# Altium project Cubesat OBC.PrjPcb (part 1 of 2)
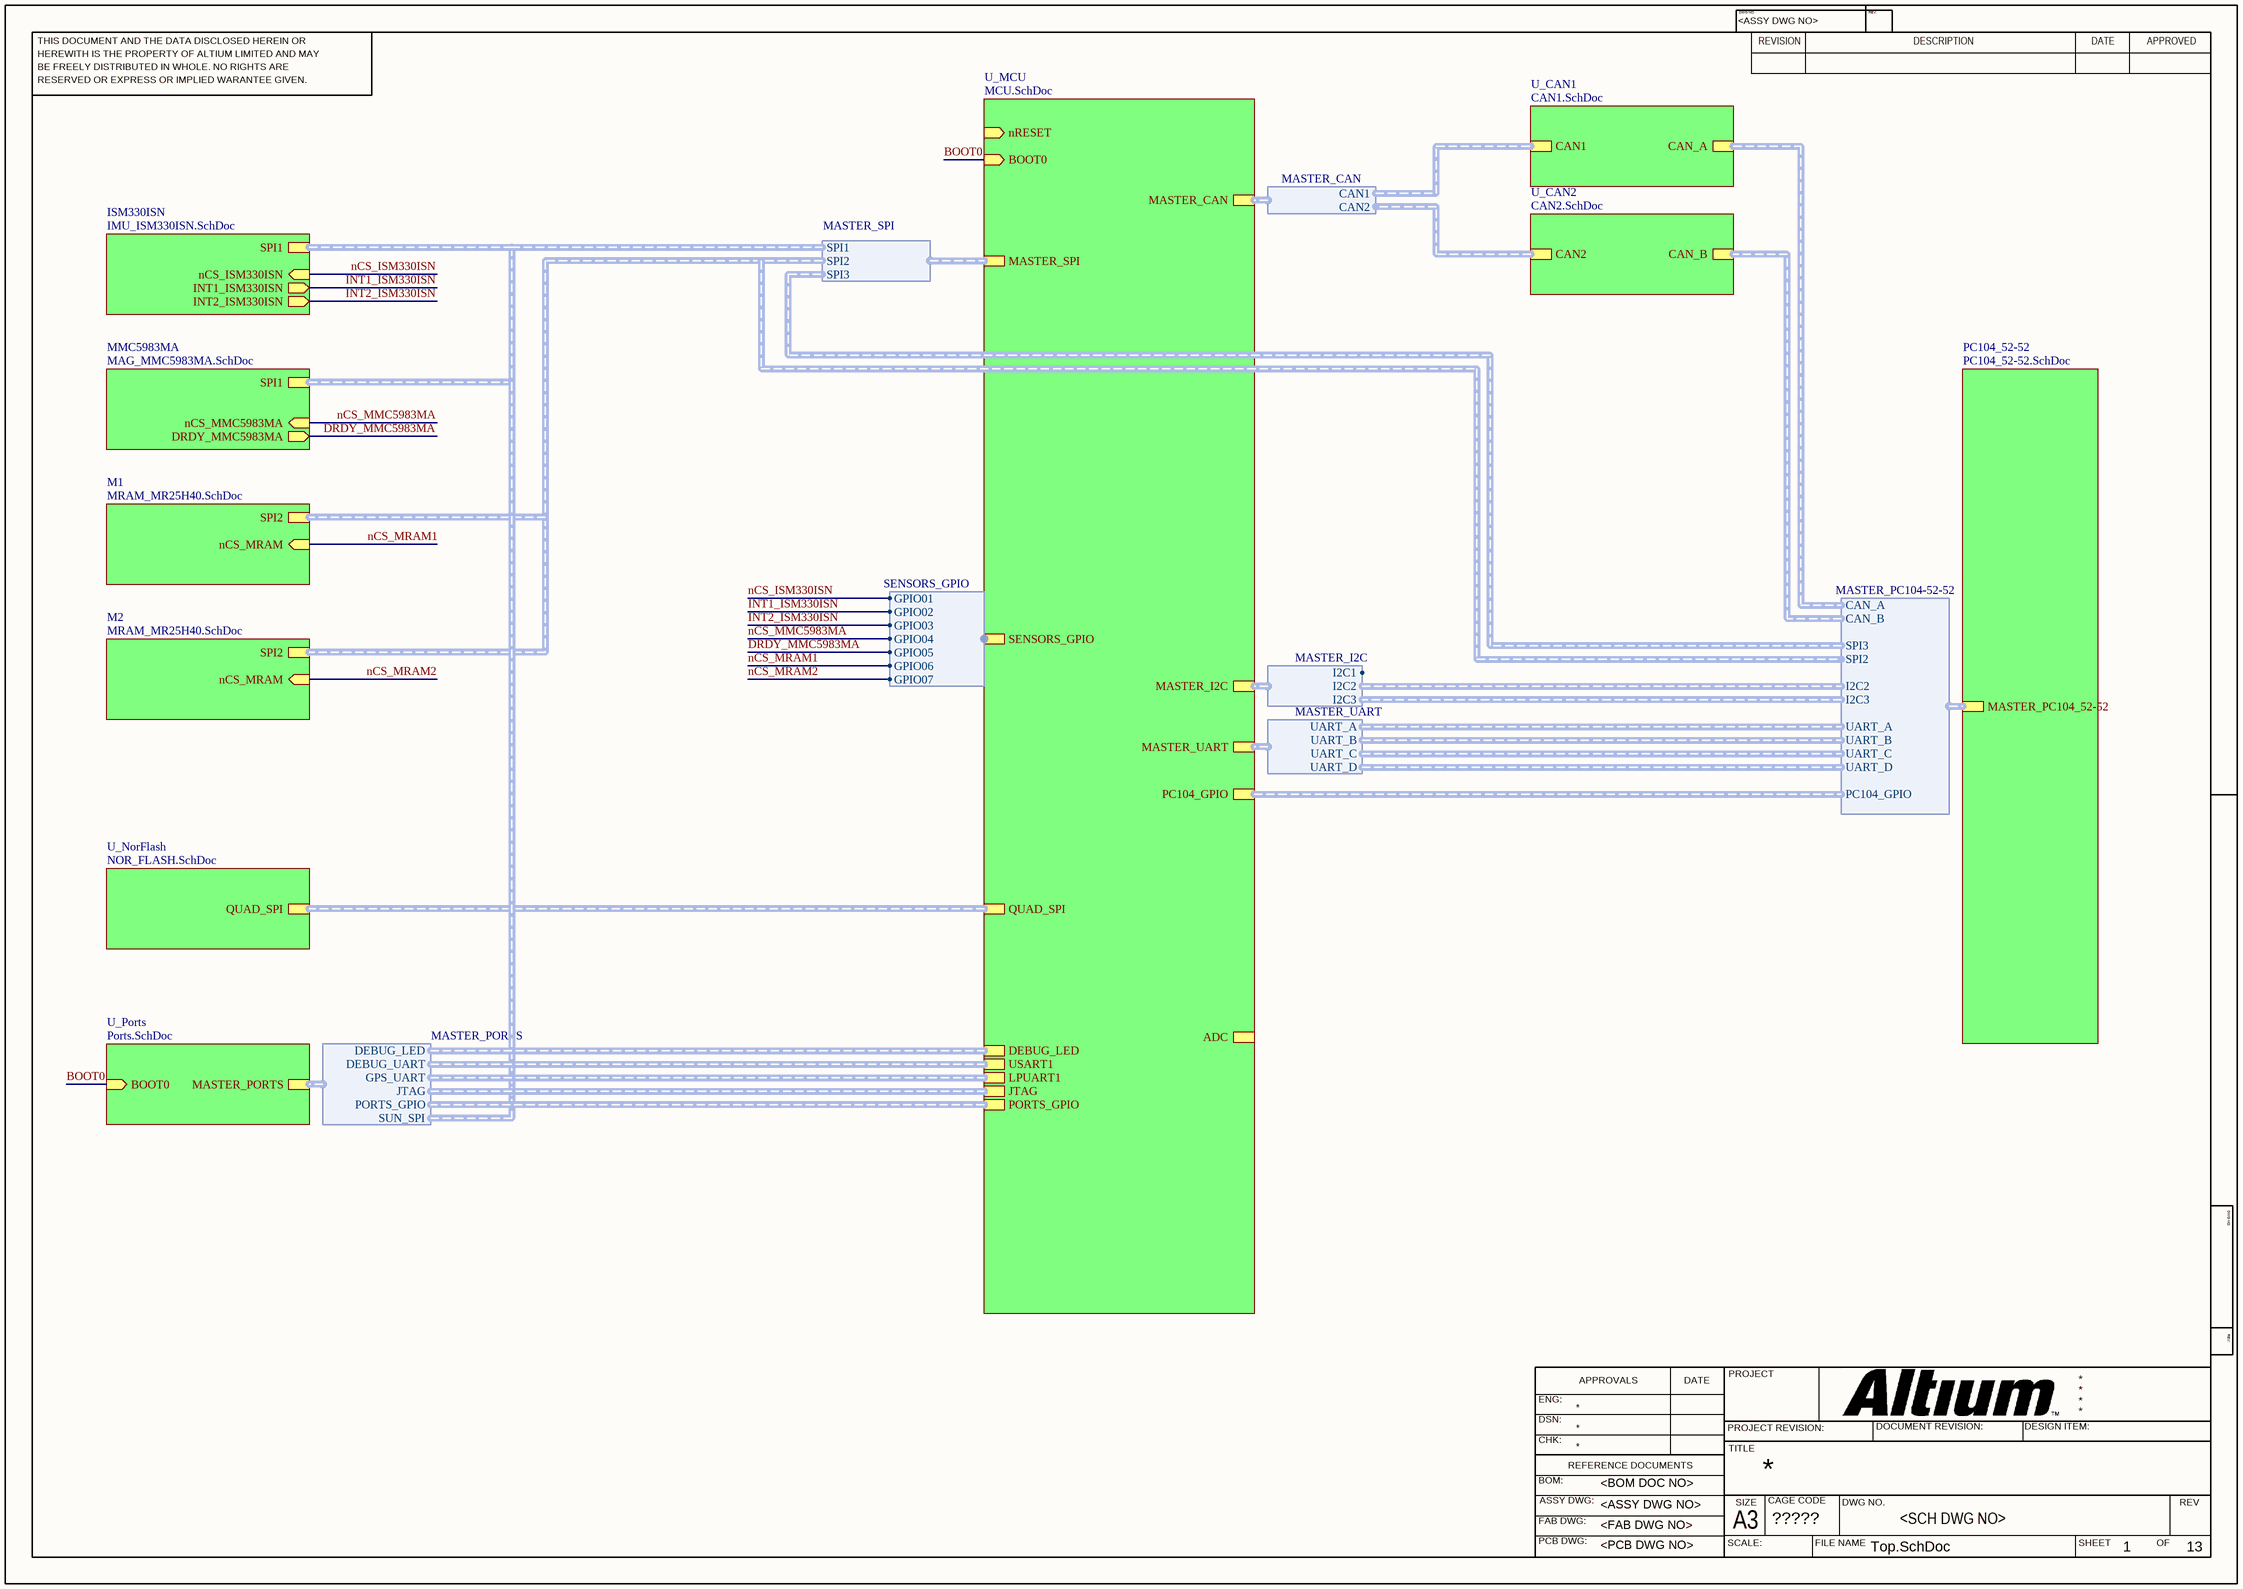
[diagram p0: Top.SchDoc]
CAGE_CODE: ?????; CONTRACT_NUMBER: <CONTRACT NO>; DOC_NO_ASSY_DWG: <ASSY DWG NO>; DOC_NO_BOM: <BOM DOC NO>; DOC_NO_FAB_DWG: <FAB DWG NO>; DOC_NO_SCH_DWG: <SCH DWG NO>; PCB_2_DEC_TOL: +/-.01; PCB_3_DEC_TOL: +/-.010; PCB_ANG_TOL: +/-1/2; PCB_ASSEMBLY_NO: <PCB ASSY NO>; PCB_CHECKER: - -----; PCB_CHECKER_APP_DATE: --/--/----; PCB_DESIGNER: - -----; PCB_DESIGNER_APP_DATE: --/--/----; PCB_DWG_NO: <PCB DWG NO>; PCB_ENGINEER: - -----; PCB_ENGINEER_APP_DATE: --/--/----; PCB_PART_NUMBER: <PCB PN>; PCB_REV: A; SCH_REV: A
13 sheets, 125 parts. Net scope: hierarchical (ports join the sheet entries above them; power ports are global).
Board file: OBC.PcbDoc
Sheets:
  Top.SchDoc
    U_MCU = MCU.SchDoc
      Crystals = Crystals.SchDoc
      MCU_Power = MCU_Power.SchDoc
      Watchdog = Watchdog.SchDoc
    U_CAN1 = CAN1.SchDoc
    U_CAN2 = CAN2.SchDoc
    M1 = MRAM_MR25H40.SchDoc
    MMC5983MA = MAG_MMC5983MA.SchDoc
    ISM330ISN = IMU_ISM330ISN.SchDoc
    M2 = MRAM_MR25H40.SchDoc
    PC104_52-52 = PC104_52-52.SchDoc
    U_NorFlash = NOR_FLASH.SchDoc
    U_Ports = Ports.SchDoc

## Sheet Top.SchDoc
size 420 x 297 mm; SheetNumber: 1; SheetTotal: 13

### Sub-sheets
ISM330ISN = IMU_ISM330ISN.SchDoc: SPI1 (harness SPI1), nCS_ISM330ISN (in), INT1_ISM330ISN (out), INT2_ISM330ISN (out)
M1 = MRAM_MR25H40.SchDoc: nCS_MRAM (in), SPI2 (harness SPI2)
M2 = MRAM_MR25H40.SchDoc: nCS_MRAM (in), SPI2 (harness SPI2)
MMC5983MA = MAG_MMC5983MA.SchDoc: nCS_MMC5983MA (in), SPI1 (harness SPI1), DRDY_MMC5983MA (out)
PC104_52-52 = PC104_52-52.SchDoc: MASTER_PC104_52-52 (harness MASTER_PC104-52-52)
U_CAN1 = CAN1.SchDoc: CAN_A (harness CAN_A), CAN1 (harness CAN1)
U_CAN2 = CAN2.SchDoc: CAN_B (harness CAN_b), CAN2 (harness CAN2)
U_MCU = MCU.SchDoc: MASTER_I2C (harness MASTER_I2C), MASTER_SPI (harness MASTER_SPI), MASTER_UART (harness MASTER_UART), MASTER_CAN (harness MASTER_CAN), QUAD_SPI (harness QUAD_SPI), nRESET (in), BOOT0 (in), JTAG (harness JTAG), DEBUG_LED (harness DEBUG_LED), USART1 (harness USART1), ADC (harness ADC), LPUART1 (harness LPUART1), PC104_GPIO (harness PC104_GPIO), PORTS_GPIO (harness PORTS_GPIO), SENSORS_GPIO (harness SENSORS_GPIO)
U_NorFlash = NOR_FLASH.SchDoc: QUAD_SPI (harness QUAD_SPI)
U_Ports = Ports.SchDoc: MASTER_PORTS (harness MASTER_PORTS), BOOT0 (in)

### Harnesses
MASTER_SPI: SPI1, SPI2, SPI3
MASTER_CAN: CAN1, CAN2
MASTER_UART: UART_A, UART_B, UART_C, UART_D
MASTER_I2C: I2C2, I2C3, I2C1
SENSORS_GPIO: GPIO01, GPIO02, GPIO03, GPIO04, GPIO05, GPIO06, GPIO07
MASTER_PC104-52-52: CAN_A, CAN_B, I2C2, I2C3, PC104_GPIO, SPI2, SPI3, UART_A, UART_B, UART_C, UART_D
MASTER_PORTS: DEBUG_LED, DEBUG_UART, GPS_UART, JTAG, PORTS_GPIO, SUN_SPI

### Nets
BOOT0: sheet U_MCU/BOOT0, sheet U_Ports/BOOT0
DRDY_MMC5983MA: sheet MMC5983MA/DRDY_MMC5983MA, sheet U_MCU/SENSORS_GPIO.GPIO05
INT1_ISM330ISN: sheet ISM330ISN/INT1_ISM330ISN, sheet U_MCU/SENSORS_GPIO.GPIO02
INT2_ISM330ISN: sheet ISM330ISN/INT2_ISM330ISN, sheet U_MCU/SENSORS_GPIO.GPIO03
nCS_ISM330ISN: sheet ISM330ISN/nCS_ISM330ISN, sheet U_MCU/SENSORS_GPIO.GPIO01
nCS_MMC5983MA: sheet MMC5983MA/nCS_MMC5983MA, sheet U_MCU/SENSORS_GPIO.GPIO04
nCS_MRAM1: sheet M1/nCS_MRAM, sheet U_MCU/SENSORS_GPIO.GPIO06  [project net nCS_MRAM]
nCS_MRAM2: sheet M2/nCS_MRAM, sheet U_MCU/SENSORS_GPIO.GPIO07  [project net nCS_MRAM]

### Buses and harness runs
harness sheet ISM330ISN/SPI1 = sheet MMC5983MA/SPI1
harness sheet M1/SPI2 = sheet M2/SPI2
harness sheet U_MCU/QUAD_SPI = sheet U_NorFlash/QUAD_SPI

### Notes on the sheet
- THIS DOCUMENT AND THE DATA DISCLOSED HEREIN OR
- HEREWITH IS THE PROPERTY OF ALTIUM LIMITED AND MAY
- DWG NO:
- REVISION
- REV:
- DESCRIPTION
- DATE
- APPROVED
- BE FREELY DISTRIBUTED IN WHOLE. NO RIGHTS ARE
- RESERVED OR EXPRESS OR IMPLIED WARANTEE GIVEN.
- ENG:
- APPROVALS
- PROJECT
- DSN:
- CHK:
- REFERENCE DOCUMENTS
- PROJECT REVISION:
- TITLE
- DOCUMENT REVISION:
- DESIGN ITEM:
- BOM:
- FAB DWG:
- PCB DWG:
- ASSY DWG:
- SCALE:
- A3
- SIZE
- CAGE CODE
- FILE NAME
- DWG NO.
- SHEET
- OF
- REV

## Sheet MCU.SchDoc
size 420 x 297 mm; SheetNumber: 2; SheetTotal: 13; ENG_APP_DATE: --/--/--; DSN_APP_DATE: --/--/--; CHK_APP_DATE: --/--/--
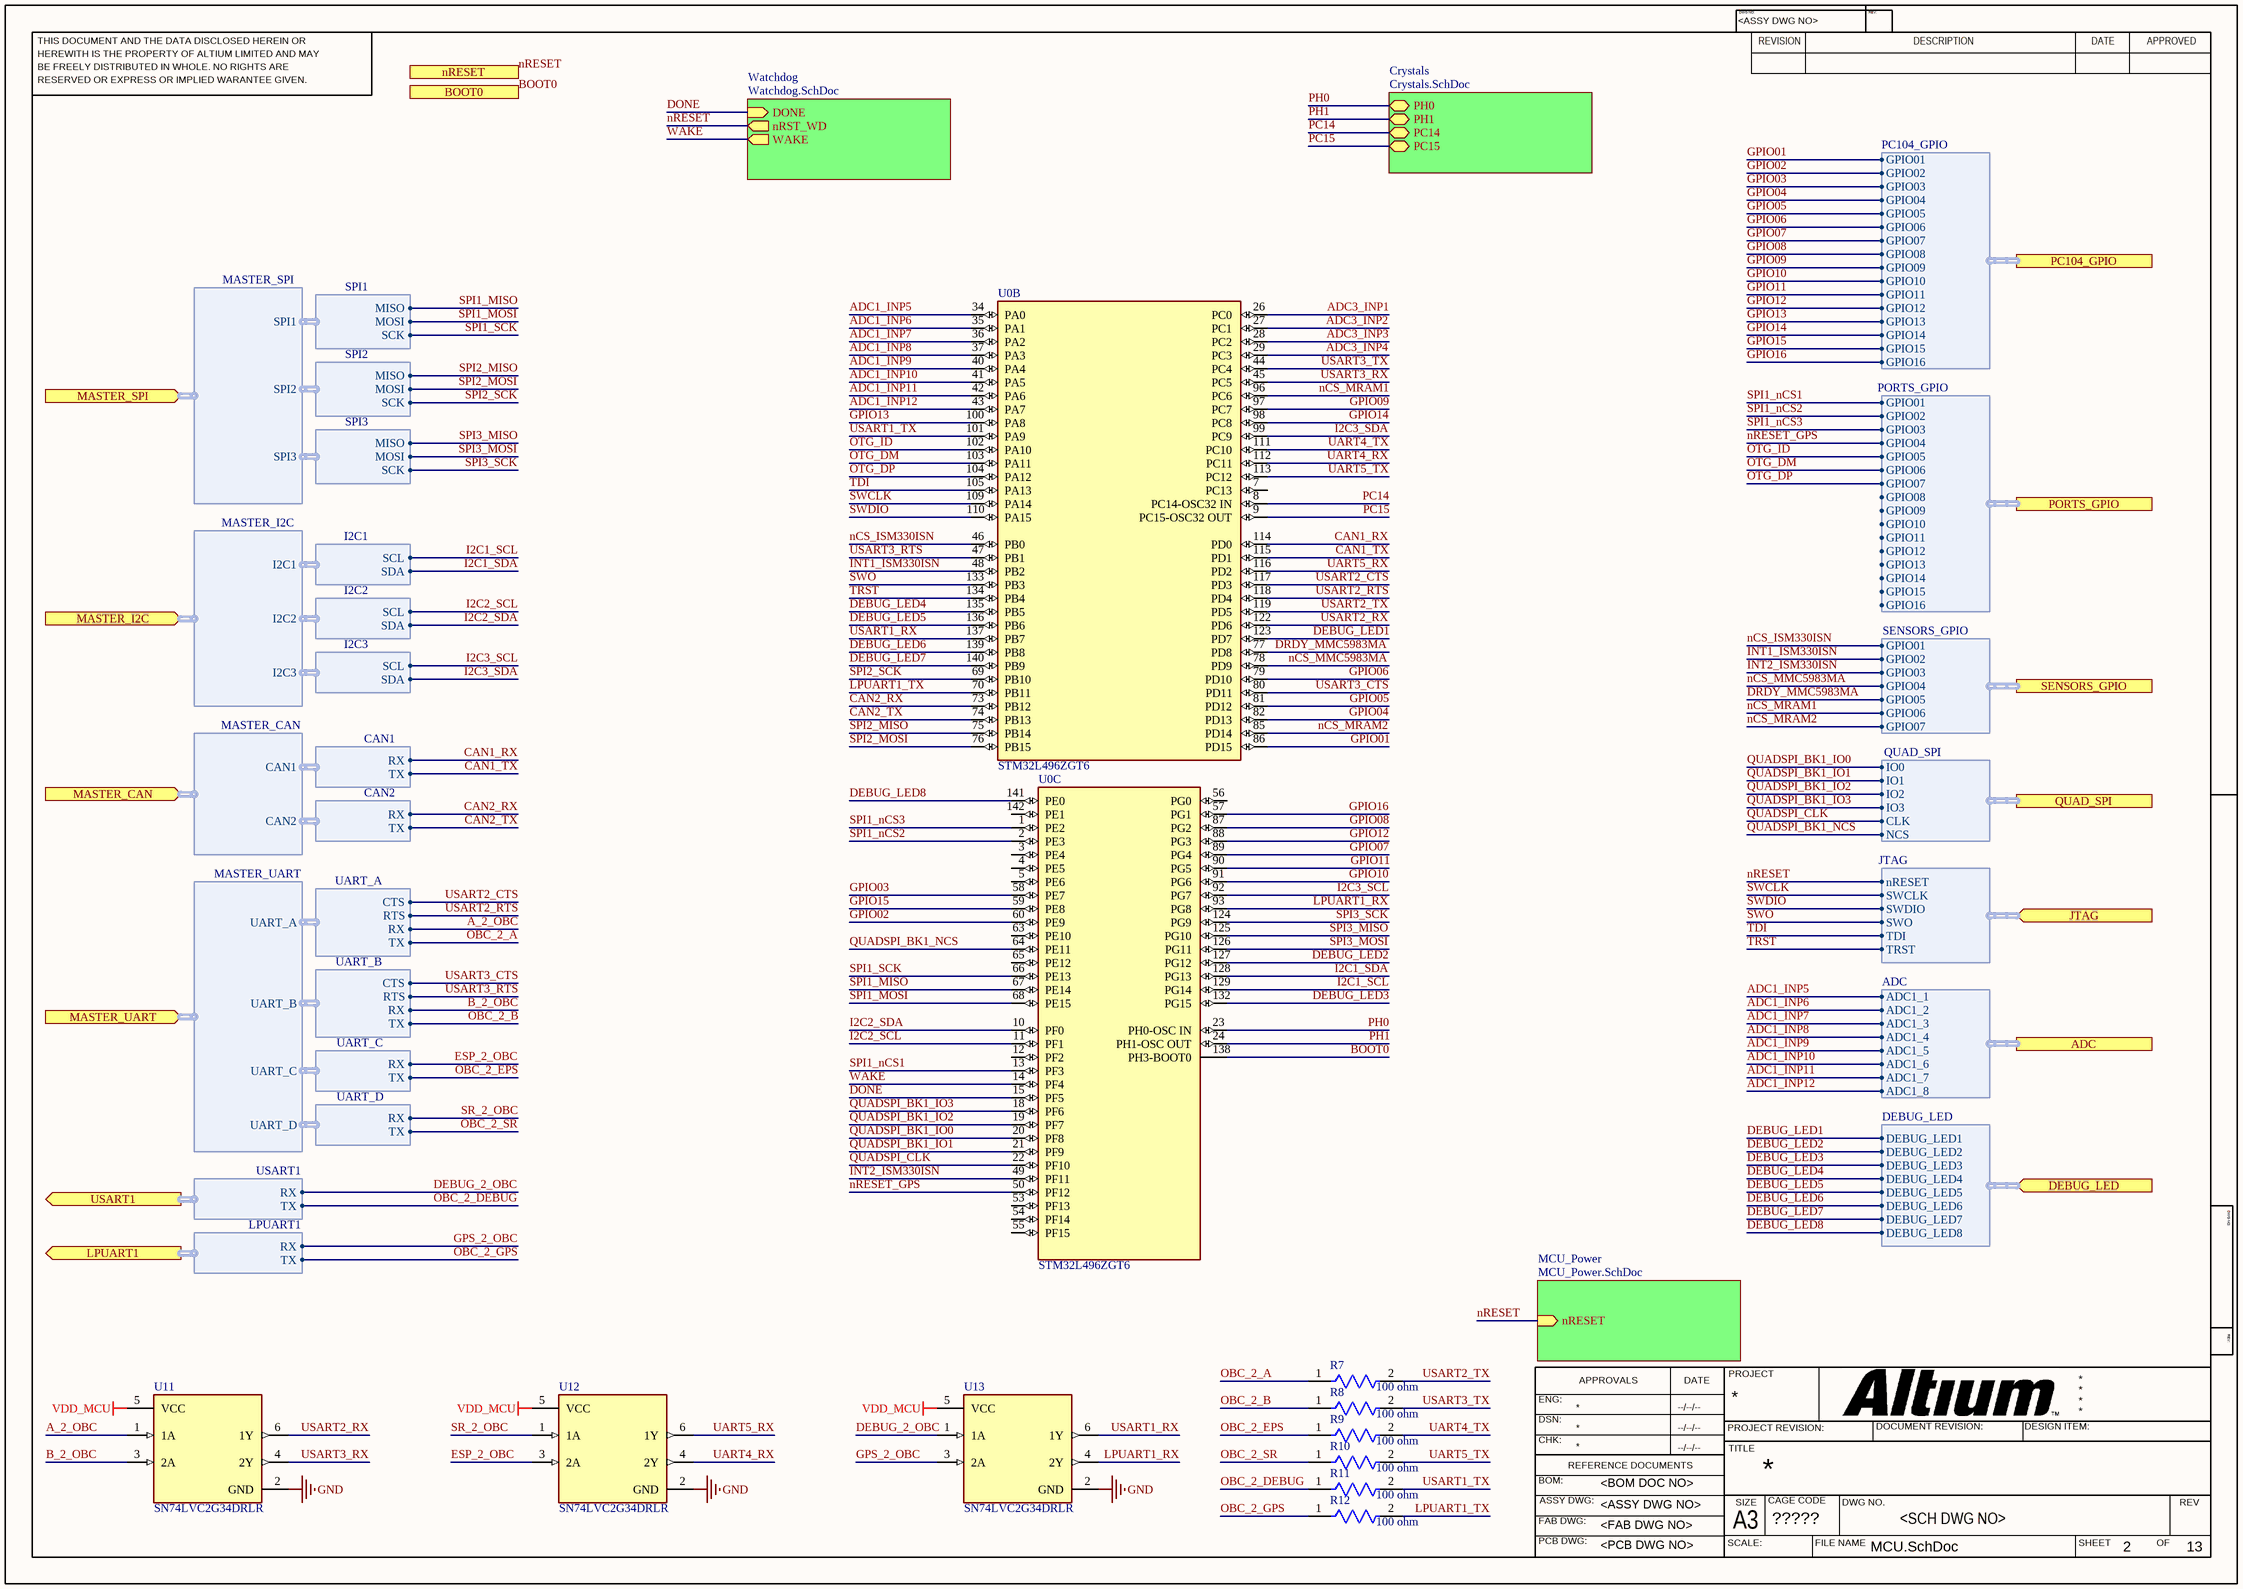
[diagram p1: MCU.SchDoc]

### Parts
R7  100 ohm  [FP-ERJP03-MFG]
R8  100 ohm  [FP-ERJP03-MFG]
R9  100 ohm  [FP-ERJP03-MFG]
R10  100 ohm  [FP-ERJP03-MFG]
R11  100 ohm  [FP-ERJP03-MFG]
R12  100 ohm  [FP-ERJP03-MFG]
U0  STM32L496ZGT6  [FP-LQFP144-1A-MFG]  (parts B,C of 3)
U11  SN74LVC2G34DRLR  [FP-DRL0006A-MFG]
U12  SN74LVC2G34DRLR  [FP-DRL0006A-MFG]
U13  SN74LVC2G34DRLR  [FP-DRL0006A-MFG]

### Sub-sheets
Crystals = Crystals.SchDoc: PC14 (bidir), PC15 (bidir), PH0 (bidir), PH1 (bidir)
MCU_Power = MCU_Power.SchDoc: nRESET (in)
Watchdog = Watchdog.SchDoc: nRST_WD (out), DONE (in), WAKE (out)

### Ports
ADC (harness ADC), BOOT0 (in), DEBUG_LED (in, harness DEBUG_LED), JTAG (in, harness JTAG), LPUART1 (out, harness LPUART1), MASTER_CAN (in, harness MASTER_CAN), MASTER_I2C (in, harness MASTER_I2C), MASTER_SPI (in, harness MASTER_SPI), MASTER_UART (in, harness MASTER_UART), nRESET (in), PC104_GPIO (harness PC104_GPIO), PORTS_GPIO (harness PORTS_GPIO), QUAD_SPI (harness QUAD_SPI), SENSORS_GPIO (harness SENSORS_GPIO), USART1 (out, harness USART1)

### Harnesses
MASTER_I2C: I2C1, I2C2, I2C3
MASTER_UART: UART_A, UART_B, UART_C, UART_D
I2C1: SDA, SCL
MASTER_SPI: SPI1, SPI2, SPI3
SPI1: MOSI, MISO, SCK
SPI2: MOSI, MISO, SCK
SPI3: MISO, SCK, MOSI
MASTER_CAN: CAN1, CAN2
CAN1: TX, RX
CAN2: TX, RX
ADC: ADC1_1, ADC1_2, ADC1_3, ADC1_4, ADC1_5, ADC1_6, ADC1_7, ADC1_8
JTAG: nRESET, SWCLK, SWDIO, SWO, TDI, TRST
I2C2: SDA, SCL
UART_A: TX, RX, RTS, CTS
UART_B: TX, RX, RTS, CTS
QUAD_SPI: IO0, IO1, CLK, NCS, IO2, IO3
I2C3: SDA, SCL
USART1: TX, RX
LPUART1: TX, RX
UART_D: TX, RX
UART_C: RX, TX
DEBUG_LED: DEBUG_LED1, DEBUG_LED2, DEBUG_LED3, DEBUG_LED4, DEBUG_LED5, DEBUG_LED6, DEBUG_LED7, DEBUG_LED8
SENSORS_GPIO: GPIO01, GPIO02, GPIO03, GPIO04, GPIO05, GPIO06, GPIO07
PORTS_GPIO: GPIO01, GPIO02, GPIO03, GPIO04, GPIO05, GPIO06, GPIO07, GPIO08, GPIO09, GPIO10, GPIO11, GPIO12, GPIO13, GPIO14, GPIO15, GPIO16
PC104_GPIO: GPIO01, GPIO02, GPIO03, GPIO04, GPIO05, GPIO06, GPIO07, GPIO08, GPIO09, GPIO10, GPIO11, GPIO12, GPIO13, GPIO14, GPIO15, GPIO16

### Nets
GND: U11.2(GND) U12.2(GND) U13.2(GND)
VDD_MCU: U11.5(VCC) U12.5(VCC) U13.5(VCC)
A_2_OBC: U11.1(1A) ; harness UART_A.RX
ADC1_INP5: U0.34(PA0) ; port ADC.ADC1_1
ADC1_INP6: U0.35(PA1) ; port ADC.ADC1_2
ADC1_INP7: U0.36(PA2) ; port ADC.ADC1_3
ADC1_INP8: U0.37(PA3) ; port ADC.ADC1_4
ADC1_INP9: U0.40(PA4) ; port ADC.ADC1_5
ADC1_INP10: U0.41(PA5) ; port ADC.ADC1_6
ADC1_INP11: U0.42(PA6) ; port ADC.ADC1_7
ADC1_INP12: U0.43(PA7) ; port ADC.ADC1_8
ADC3_INP1: U0.26(PC0)
ADC3_INP2: U0.27(PC1)
ADC3_INP3: U0.28(PC2)
ADC3_INP4: U0.29(PC3)
B_2_OBC: U11.3(2A) ; harness UART_B.RX
BOOT0: U0.138(PH3-BOOT0) ; port BOOT0
CAN1_RX: U0.114(PD0) ; harness CAN1.RX
CAN1_TX: U0.115(PD1) ; harness CAN1.TX
CAN2_RX: U0.73(PB12) ; harness CAN2.RX
CAN2_TX: U0.74(PB13) ; harness CAN2.TX
DEBUG_2_OBC: U13.1(1A) ; port USART1.RX
DEBUG_LED1: U0.123(PD7) ; port DEBUG_LED.DEBUG_LED1
DEBUG_LED2: U0.127(PG12) ; port DEBUG_LED.DEBUG_LED2
DEBUG_LED3: U0.132(PG15) ; port DEBUG_LED.DEBUG_LED3
DEBUG_LED4: U0.135(PB5) ; port DEBUG_LED.DEBUG_LED4
DEBUG_LED5: U0.136(PB6) ; port DEBUG_LED.DEBUG_LED5
DEBUG_LED6: U0.139(PB8) ; port DEBUG_LED.DEBUG_LED6
DEBUG_LED7: U0.140(PB9) ; port DEBUG_LED.DEBUG_LED7
DEBUG_LED8: U0.141(PE0) ; port DEBUG_LED.DEBUG_LED8
DONE: U0.15(PF5) ; sheet Watchdog/DONE
DRDY_MMC5983MA: U0.77(PD8) ; port SENSORS_GPIO.GPIO05
ESP_2_OBC: U12.3(2A) ; harness UART_C.RX
GPIO01: U0.86(PD15) ; port PC104_GPIO.GPIO01
GPIO02: U0.60(PE9) ; port PC104_GPIO.GPIO02
GPIO03: U0.58(PE7) ; port PC104_GPIO.GPIO03
GPIO04: U0.82(PD13) ; port PC104_GPIO.GPIO04
GPIO05: U0.81(PD12) ; port PC104_GPIO.GPIO05
GPIO06: U0.79(PD10) ; port PC104_GPIO.GPIO06
GPIO07: U0.89(PG4) ; port PC104_GPIO.GPIO07
GPIO08: U0.87(PG2) ; port PC104_GPIO.GPIO08
GPIO09: U0.97(PC7) ; port PC104_GPIO.GPIO09
GPIO10: U0.91(PG6) ; port PC104_GPIO.GPIO10
GPIO11: U0.90(PG5) ; port PC104_GPIO.GPIO11
GPIO12: U0.88(PG3) ; port PC104_GPIO.GPIO12
GPIO13: U0.100(PA8) ; port PC104_GPIO.GPIO13
GPIO14: U0.98(PC8) ; port PC104_GPIO.GPIO14
GPIO15: U0.59(PE8) ; port PC104_GPIO.GPIO15
GPIO16: U0.57(PG1) ; port PC104_GPIO.GPIO16
GPS_2_OBC: U13.3(2A) ; port LPUART1.RX
I2C1_SCL: U0.129(PG14) ; harness I2C1.SCL
I2C1_SDA: U0.128(PG13) ; harness I2C1.SDA
I2C2_SCL: U0.11(PF1) ; harness I2C2.SCL
I2C2_SDA: U0.10(PF0) ; harness I2C2.SDA
I2C3_SCL: U0.92(PG7) ; harness I2C3.SCL
I2C3_SDA: U0.99(PC9) ; harness I2C3.SDA
INT1_ISM330ISN: U0.48(PB2) ; port SENSORS_GPIO.GPIO02
INT2_ISM330ISN: U0.49(PF11) ; port SENSORS_GPIO.GPIO03
LPUART1_RX: U0.93(PG8) U13.4(2Y)
LPUART1_TX: R12.2 U0.70(PB11)
nCS_ISM330ISN: U0.46(PB0) ; port SENSORS_GPIO.GPIO01
nCS_MMC5983MA: U0.78(PD9) ; port SENSORS_GPIO.GPIO04
nCS_MRAM1: U0.96(PC6) ; port SENSORS_GPIO.GPIO06  [project net nCS_MRAM]
nCS_MRAM2: U0.85(PD14) ; port SENSORS_GPIO.GPIO07  [project net nCS_MRAM]
nRESET: port nRESET, sheet MCU_Power/nRESET, sheet Watchdog/nRST_WD, port JTAG.nRESET
nRESET_GPS: U0.50(PF12) ; port PORTS_GPIO.GPIO04
OBC_2_A: R7.1 ; harness UART_A.TX
OBC_2_B: R8.1 ; harness UART_B.TX
OBC_2_DEBUG: R11.1 ; port USART1.TX
OBC_2_EPS: R9.1 ; harness UART_C.TX
OBC_2_GPS: R12.1 ; port LPUART1.TX
OBC_2_SR: R10.1 ; harness UART_D.TX
OTG_DM: U0.103(PA11) ; port PORTS_GPIO.GPIO06
OTG_DP: U0.104(PA12) ; port PORTS_GPIO.GPIO07
OTG_ID: U0.102(PA10) ; port PORTS_GPIO.GPIO05
PC14: U0.8(PC14-OSC32_IN) ; sheet Crystals/PC14
PC15: U0.9(PC15-OSC32_OUT) ; sheet Crystals/PC15
PH0: U0.23(PH0-OSC_IN) ; sheet Crystals/PH0
PH1: U0.24(PH1-OSC_OUT) ; sheet Crystals/PH1
QUADSPI_BK1_IO0: U0.20(PF8) ; port QUAD_SPI.IO0
QUADSPI_BK1_IO1: U0.21(PF9) ; port QUAD_SPI.IO1
QUADSPI_BK1_IO2: U0.19(PF7) ; port QUAD_SPI.IO2
QUADSPI_BK1_IO3: U0.18(PF6) ; port QUAD_SPI.IO3
QUADSPI_BK1_NCS: U0.64(PE11) ; port QUAD_SPI.NCS
QUADSPI_CLK: U0.22(PF10) ; port QUAD_SPI.CLK
SPI1_MISO: U0.67(PE14) ; harness SPI1.MISO
SPI1_MOSI: U0.68(PE15) ; harness SPI1.MOSI
SPI1_nCS1: U0.13(PF3) ; port PORTS_GPIO.GPIO01
SPI1_nCS2: U0.2(PE3) ; port PORTS_GPIO.GPIO02
SPI1_nCS3: U0.1(PE2) ; port PORTS_GPIO.GPIO03
SPI1_SCK: U0.66(PE13) ; harness SPI1.SCK
SPI2_MISO: U0.75(PB14) ; harness SPI2.MISO
SPI2_MOSI: U0.76(PB15) ; harness SPI2.MOSI
SPI2_SCK: U0.69(PB10) ; harness SPI2.SCK
SPI3_MISO: U0.125(PG10) ; harness SPI3.MISO
SPI3_MOSI: U0.126(PG11) ; harness SPI3.MOSI
SPI3_SCK: U0.124(PG9) ; harness SPI3.SCK
SR_2_OBC: U12.1(1A) ; harness UART_D.RX
SWCLK: U0.109(PA14) ; port JTAG.SWCLK
SWDIO: U0.110(PA15) ; port JTAG.SWDIO
SWO: U0.133(PB3) ; port JTAG.SWO
TDI: U0.105(PA13) ; port JTAG.TDI
TRST: U0.134(PB4) ; port JTAG.TRST
UART4_RX: U0.112(PC11) U12.4(2Y)
UART4_TX: R9.2 U0.111(PC10)
UART5_RX: U0.116(PD2) U12.6(1Y)
UART5_TX: R10.2 U0.113(PC12)
USART1_RX: U0.137(PB7) U13.6(1Y)
USART1_TX: R11.2 U0.101(PA9)
USART2_CTS: U0.117(PD3) ; harness UART_A.CTS  [project net UART_A_CTS]
USART2_RTS: U0.118(PD4) ; harness UART_A.RTS  [project net UART_A_RTS]
USART2_RX: U0.122(PD6) U11.6(1Y)
USART2_TX: R7.2 U0.119(PD5)
USART3_CTS: U0.80(PD11) ; harness UART_B.CTS  [project net UART_B_CTS]
USART3_RTS: U0.47(PB1) ; harness UART_B.RTS  [project net UART_B_RTS]
USART3_RX: U0.45(PC5) U11.4(2Y)
USART3_TX: R8.2 U0.44(PC4)
WAKE: U0.14(PF4) ; sheet Watchdog/WAKE

Not connected (* = marked no-connect by the designer): U0 3(PE4) 4(PE5) 5(PE6) 7(PC13) 12(PF2) 53(PF13) 54(PF14) 55(PF15) 56(PG0) 63(PE10) 65(PE12) 142(PE1)

### Notes on the sheet
- THIS DOCUMENT AND THE DATA DISCLOSED HEREIN OR
- HEREWITH IS THE PROPERTY OF ALTIUM LIMITED AND MAY
- DWG NO:
- REVISION
- REV:
- DESCRIPTION
- DATE
- APPROVED
- BE FREELY DISTRIBUTED IN WHOLE. NO RIGHTS ARE
- RESERVED OR EXPRESS OR IMPLIED WARANTEE GIVEN.
- ENG:
- APPROVALS
- PROJECT
- DSN:
- CHK:
- REFERENCE DOCUMENTS
- PROJECT REVISION:
- TITLE
- DOCUMENT REVISION:
- DESIGN ITEM:
- BOM:
- FAB DWG:
- PCB DWG:
- ASSY DWG:
- SCALE:
- A3
- SIZE
- CAGE CODE
- FILE NAME
- DWG NO.
- SHEET
- OF
- REV

### Library data of the parts
R7-R12 = CMP-00287-21317759-1: ERJ-P03F1000V SMD Chip Resistor, 100 Ohm, ± 1%, 200 mW, 0603 [1608 Metric], Thick Film, Anti-Surge; Temperature Coefficient: 200ppm/°C; Resistance: 100Ω; Voltage Rating (DC): 150V; Power Rating: 200mW; Tolerance: 1%; Termination: Tab; RoHS: Compliant; Composition: Thick Film; Min Operating Temperature: -55°C; Contact Plating: Tin; Case Code (Metric): 1608; Case/Package: 0603; Radiation Hardening: No; Mount: Surface Mount; Voltage Rating: 150V; Packaging: Cut Tape; Length: 1.6mm; REACH SVHC: No SVHC; Max Operating Temperature: 155°C; Depth: 800µm; Number of Pins: 2; Lifecycle Status: Production; Schedule B: 8533210045, 8533210045; Military Standard: Not; Height: 550µm; NexarPartId: 21317759; Case Code (Imperial): 0603
U0 = CMP-12105-000038-2: IC MCU 32BIT 1MB FLASH 144LQFP; Manufacturer Package Identifier: LQFP144-1A; NexarPartId: 80927210; Number of Channels: 24; Number of I2C Channels: 4; Frequency: 80MHz; Number of USB Channels: 1; Nominal Supply Current: 30nA; Data Bus Width: 32b; Number of Timers/Counters: 2; Number of USART Channels: 3; Max Junction Temperature (Tj): 105°C; Number of I/Os: 115; Number of PWM Channels: 28; Interface: CAN, I2C, I2S, IrDA, LIN, SPI, UART, USART, USB; Core Architecture: ARM Cortex-M4; RAM Size: 320kB; Min Supply Voltage: 1.05V; Max Supply Voltage: 3.6V; Min Operating Temperature: -40°C; RoHS: Non-Compliant; Memory Size: 1MB; Number of A/D Converters: 3; Number of SPI Channels: 3; Max Operating Temperature: 85°C; Memory Type: FLASH; Height: 1.6mm; Ambient Temperature Range High: 85°C; Schedule B: 8542310000, 8542310000; Number of D/A Converters: 2; Number of UART Channels: 2; Lifecycle Status: Production; Flash Memory Size: 1MB; Number of ADC Channels: 24
U11-U13 = CMP-0859-00812-4: IC BUFFER NON-INVERT 5.5V 6SOT; Number of Bits per Element: 1; Number of Bits: 2; Low Level Output Current: 32mA; Polarity: Non-Inverting; Min Supply Voltage: 1.65V; Propagation Delay: 8.6ns; High Level Output Current: -32mA; Quiescent Current: 10uA; Contact Plating: Gold; Case/Package: SOT; Technology: CMOS; Min Operating Temperature: -40°C; Number of Elements: 2; REACH SVHC: No SVHC; Number of Channels: 2; Series: 74LVC; Number of Pins: 6; Mount: Surface Mount; Logic Function: Buffer; Number of Output Lines: 2; Packaging: Tape and Reel; Package Quantity: 4000; Radiation Hardening: No; Number of Gates: 2; Turn-On Delay Time: 8.6ns; Max Operating Temperature: 125°C; Max Supply Voltage: 5.5V; Lead Free: Lead Free; RoHS Compliant: Yes; Number of Outputs: 2; Number of Inputs: 2; Number of Input Lines: 2

## Sheet Crystals.SchDoc
size 420 x 297 mm; SheetNumber: 5; SheetTotal: 13
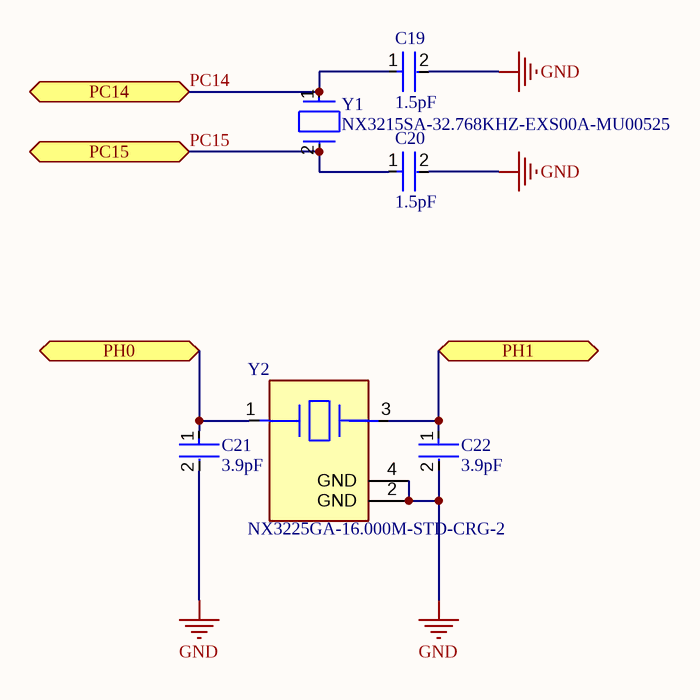
[diagram p2: Crystals.SchDoc]

### Parts
C19  1.5pF  [FP-C0603C-CF-MFG]
C20  1.5pF  [FP-C0603C-CF-MFG]
C21  3.9pF  [FP-CBR06C-MFG]
C22  3.9pF  [FP-CBR06C-MFG]
Y1  NX3215SA-32.768KHZ-EXS00A-MU00525  [FP-NX3215SA-MFG]
Y2  NX3225GA-16.000M-STD-CRG-2  [FP-NX3225GA-MFG]

### Ports
PC14 (bidir), PC15 (bidir), PH0 (bidir), PH1 (bidir)

### Nets
GND: C19.2 C20.2 C21.2 C22.2 Y2.2(GND) Y2.4(GND)
PC14: C19.1 Y1.1 ; port PC14
PC15: C20.1 Y1.2 ; port PC15
PH0: C21.1 Y2.1 ; port PH0
PH1: C22.1 Y2.3 ; port PH1

### Notes on the sheet
- THIS DOCUMENT AND THE DATA DISCLOSED HEREIN OR
- HEREWITH IS THE PROPERTY OF ALTIUM LIMITED AND MAY
- DWG NO:
- REVISION
- REV:
- DESCRIPTION
- DATE
- APPROVED
- BE FREELY DISTRIBUTED IN WHOLE. NO RIGHTS ARE
- RESERVED OR EXPRESS OR IMPLIED WARANTEE GIVEN.
- ENG:
- APPROVALS
- PROJECT
- DSN:
- CHK:
- REFERENCE DOCUMENTS
- PROJECT REVISION:
- TITLE
- DOCUMENT REVISION:
- DESIGN ITEM:
- BOM:
- FAB DWG:
- PCB DWG:
- ASSY DWG:
- SCALE:
- A3
- SIZE
- CAGE CODE
- FILE NAME
- DWG NO.
- SHEET
- OF
- REV

### Library data of the parts
C19 C20 = CMP-2006-03373-2: CAP CER 1.5PF 100V NP0 0603; Manufacturer Part Number: C0603C159C1GACTU; Manufacturer: KEMET; Material: Ceramic; Temperature Coefficient: 30ppm/°C; Temperature Characteristic: C0G; Tolerance: 0.25 pF; Automotive Grade: Grade 1; Mouser Description: Multilayer Ceramic Capacitors MLCC - SMD/SMT 100volts 1.5pF C0G 0.25%; Lead Free: Yes; Value: 1.5 pF; Temperature Range Low: -55°C; Temperature: -55°C to +125°C; Device Class L1: Passive Components; Device Class L3: Ceramic Capacitors; Package: C0603C-CF; Category: Cap; ComponentLink2Description: Datasheet; Voltage Rating: 100 V; Device Class L2: Capacitors; Height: 0.87mm; Temperature Range High: +125°C; RoHS: TRUE; Octopart: https://octopart.com/c0603c159c1gactu-kemet-9144220; Digikey Description: CAP CER 1.5PF 100V NP0 0603; Automotive: Yes; ComponentLink2URL: https://api.kemet.com/component-edge/download/datasheet/C0603C100J5GACAUTO.pdf; Capacitance: 1.5 pF
C21 C22 = CMP-2006-02987-2: CAP CER 3.9PF 250V C0G/NP0 0603; Manufacturer Part Number: CBR06C399CAGAC; Manufacturer: KEMET; Material: Ceramic; Tolerance: 0.25 pF; Temperature Characteristic: C0G; Temperature Coefficient: 30ppm/°C; Octopart: https://octopart.com/cbr06c399cagac-kemet-20446767; Height: 0.87mm; Category: Cap; Temperature: -55°C to +125°C; Device Class L1: Passive Components; Capacitance: 3.9 pF; Device Class L3: Ceramic Capacitors; Value: 3.9 pF; Voltage Rating: 250 V; Mouser Description: Multilayer Ceramic Capacitors MLCC - SMD/SMT 250volts 3.9pF C0G 0603 .25pF Tol RF; Temperature Range High: +125°C; Ipc Land Pattern Name: CAPC16080X80; ComponentLink2Description: Datasheet; Temperature Range Low: -55°C; Digikey Description: CAP CER 3.9PF 250V C0G/NP0 0603; ComponentLink2URL: https://content.kemet.com/datasheets/KEM_C1030_CBR_SMD.pdf; Lead Free: Yes; Package: CBR06C; Device Class L2: Capacitors; RoHS: TRUE; Automotive: No
Y1 = CMP-200220-000018-1: CRYSTAL 32.7680KHZ 6PF SMD; ESR (Equivalent Series Resistance): 70kR; Load Capacitance: 6pF; Frequency: 32.768kHz; Case/Package: SMD/SMT; Packaging: Tape and Reel; Ratings: AEC-Q200; Max Operating Temperature: 85°C; Mount: Surface Mount; Min Operating Temperature: -40°C
Y2 = CMP-200220-000007-1: CRYSTAL 16.0000MHZ 8PF SMD; Frequency Stability: 30ppm; Frequency Tolerance: 20ppm; Frequency: 16MHz; ESR (Equivalent Series Resistance): 80R; Min Operating Temperature: -40°C; Mount: Surface Mount; Width: 0.098inch; Case/Package: SMD/SMT; Max Operating Temperature: 85°C; Number of Pins: 4; Length: 0.126inch; Load Capacitance: 8pF; Packaging: Tape and Reel; Package Quantity: 3000; Height: 0.035inch

## Sheet MCU_Power.SchDoc
size 420 x 297 mm; SheetNumber: 3; SheetTotal: 13
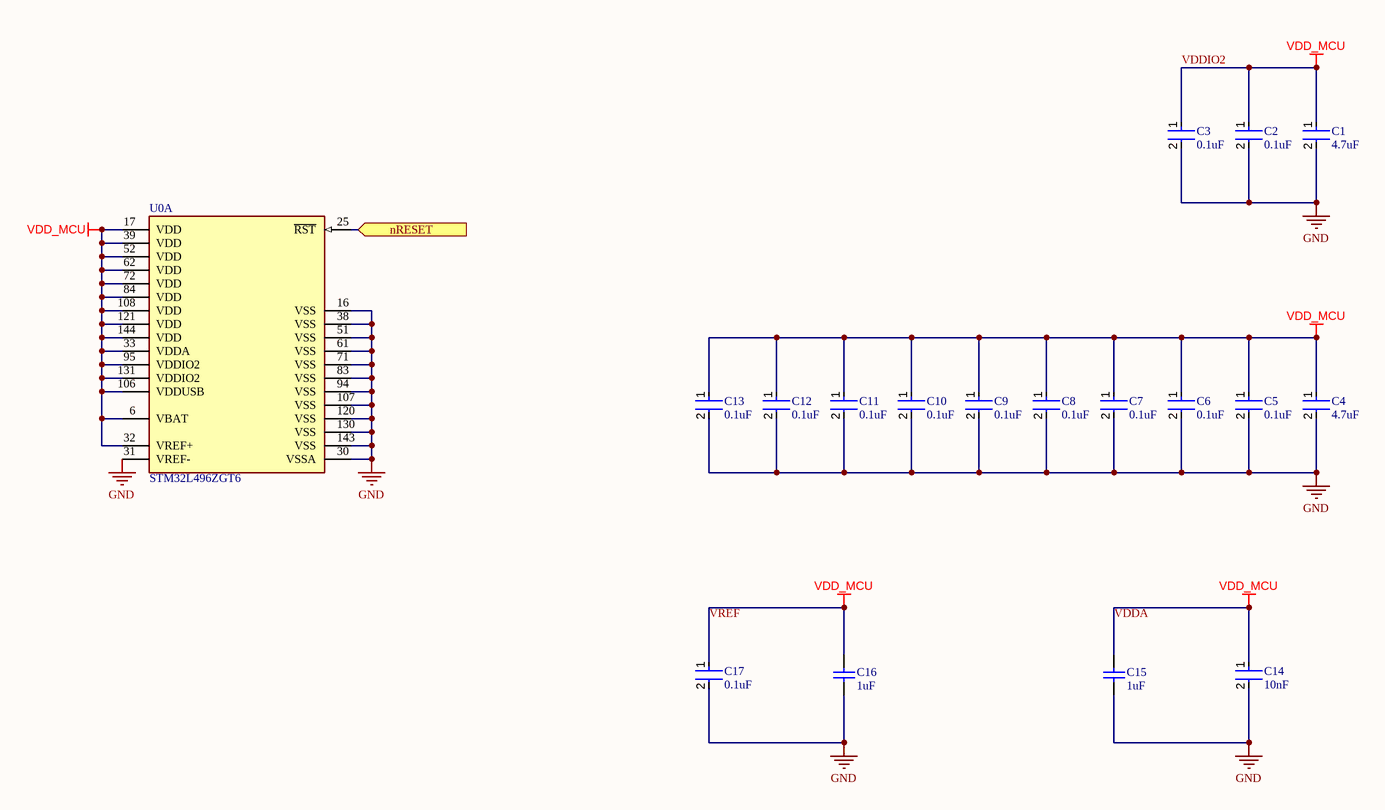
[diagram p3: MCU_Power.SchDoc]

### Parts
C1  4.7uF  [FP-GRM188-0_15-IPC_A]
C2  0.1uF  [FP-C0603C-CF-MFG]
C3  0.1uF  [FP-C0603C-CF-MFG]
C4  4.7uF  [FP-GRM188-0_15-IPC_A]
C5  0.1uF  [FP-C0603C-CF-MFG]
C6  0.1uF  [FP-C0603C-CF-MFG]
C7  0.1uF  [FP-C0603C-CF-MFG]
C8  0.1uF  [FP-C0603C-CF-MFG]
C9  0.1uF  [FP-C0603C-CF-MFG]
C10  0.1uF  [FP-C0603C-CF-MFG]
C11  0.1uF  [FP-C0603C-CF-MFG]
C12  0.1uF  [FP-C0603C-CF-MFG]
C13  0.1uF  [FP-C0603C-CF-MFG]
C14  10nF  [FP-GRM188-0_1-e0_2_0_5-IPC_A]
C15  1uF  [CAPC1608X90X35LL15T15]
C16  1uF  [CAPC1608X90X35LL15T15]
C17  0.1uF  [FP-C0603C-CF-MFG]
U0  STM32L496ZGT6  [FP-LQFP144-1A-MFG]  (part A of 3)

### Ports
nRESET (in)

### Nets
GND: C1.2 C2.2 C3.2 C4.2 C5.2 C6.2 C7.2 C8.2 C9.2 C10.2 C11.2 C12.2 C13.2 C14.2 C15.2 C16.2 C17.2 U0.16(VSS) U0.30(VSSA) U0.31(VREF-) U0.38(VSS) U0.51(VSS) U0.61(VSS) U0.71(VSS) U0.83(VSS) U0.94(VSS) U0.107(VSS) U0.120(VSS) U0.130(VSS) U0.143(VSS)
VDD_MCU: C1.1 C2.1 C3.1 C4.1 C5.1 C6.1 C7.1 C8.1 C9.1 C10.1 C11.1 C12.1 C13.1 C14.1 C15.1 C16.1 C17.1 U0.6(VBAT) U0.17(VDD) U0.32(VREF+) U0.33(VDDA) U0.39(VDD) U0.52(VDD) U0.62(VDD) U0.72(VDD) U0.84(VDD) U0.95(VDDIO2) U0.106(VDDUSB) U0.108(VDD) U0.121(VDD) U0.131(VDDIO2) U0.144(VDD)  [also labelled VDDA, VDDIO2, VREF]
nRESET: U0.25(~{RST}) ; port nRESET

### Notes on the sheet
- THIS DOCUMENT AND THE DATA DISCLOSED HEREIN OR
- HEREWITH IS THE PROPERTY OF ALTIUM LIMITED AND MAY
- DWG NO:
- REVISION
- REV:
- DESCRIPTION
- DATE
- APPROVED
- BE FREELY DISTRIBUTED IN WHOLE. NO RIGHTS ARE
- RESERVED OR EXPRESS OR IMPLIED WARANTEE GIVEN.
- ENG:
- APPROVALS
- PROJECT
- DSN:
- CHK:
- REFERENCE DOCUMENTS
- PROJECT REVISION:
- TITLE
- DOCUMENT REVISION:
- DESIGN ITEM:
- BOM:
- FAB DWG:
- PCB DWG:
- ASSY DWG:
- SCALE:
- A3
- SIZE
- CAGE CODE
- FILE NAME
- DWG NO.
- SHEET
- OF
- REV

### Library data of the parts
C1 C4 = CMP-06035-000034-2: CAP CER 4.7UF 10V X7S 0603; Material: Ceramic; Tolerance: 10%; Height: 0.8mm; Termination: SMD/SMT; Case Code (Metric): 1608; Voltage Rating: 10V; Width: 0.8mm; Resistor Type: Ceramic; Length: 1.6mm; Voltage Rating (DC): 10V; Weight: 0.000222oz; Dielectric: X7S; Package Quantity: 4000; Mount: Surface Mount; Case Code (Imperial): 0603; Case/Package: 0603; Packaging: Tape and Reel; Thickness: 0.037inch; Min Operating Temperature: -55°C; Capacitance: 4.7uF; Max Operating Temperature: 125°C
C2 C3 C5-C13 C17 = CMP-2006-03061-2: CAP CER 0.1UF 50V X7R 0603; Manufacturer: KEMET; Manufacturer Part Number: C0603C104K5RACTU; Tolerance: 0.1; Temperature Coefficient: 30ppm/°C; Material: Ceramic; Automotive Grade: Grade 1; Value: 0.10 μF; Temperature: -55°C to +125°C; RoHS: TRUE; Temperature Range High: +125°C; Lead Free: Yes; Octopart: https://octopart.com/c0603c104k5ractu-kemet-139244; Digikey Description: CAP CER 0.1UF 50V X7R 0603; Category: Cap; Package: C0603C-CF; ComponentLink2Description: Datasheet; Temperature Range Low: -55°C; Device Class L1: Passive Components; Voltage Rating: 50 V; Automotive: Yes; Device Class L3: Ceramic Capacitors; ComponentLink2URL: https://api.kemet.com/component-edge/download/datasheet/C0603C100J5GACAUTO.pdf; Capacitance: 0.10 μF; Device Class L2: Capacitors; Temperature Characteristic: X7R; Height: 0.87mm
C14 = CMP-2006-02943-2: Chip Multilayer Ceramic Capacitors for General Purpose, 0603, 10000pF, X7R, 15%, 10%, 100V; Capacitance: 10nF; Dielectric: X7R; Material: Ceramic; Package Quantity: 4000; Voltage: 100V; Mount: Surface Mount; Min Operating Temperature: -55°C; Thickness: 0.035inch; Height: 0.8mm; Max Operating Temperature: 125°C; Radiation Hardening: No; Lead Free: Lead Free; Case Code (Metric): 1608; REACH SVHC: No SVHC; Termination: SMD/SMT; Tolerance: 10%; Voltage Rating: 100V; Voltage Rating (DC): 100V; Length: 1.6mm; Depth: 0.8mm; Width: 0.031inch; Case Code (Imperial): 0603; Case/Package: 0603; Packaging: Tape and Reel
C15 C16 = CMP-2006-02298-2: Manufacturer: Kemet; Part Number: C0603C105K4RACTU
U0 = CMP-12105-000038-2: as U0 on sheet MCU; Min Operating Temperature: -40°C; RoHS: Non-Compliant; Memory Size: 1MB; Number of A/D Converters: 3; Number of SPI Channels: 3; Max Operating Temperature: 85°C; Memory Type: FLASH; Height: 1.6mm; Ambient Temperature Range High: 85°C; Schedule B: 8542310000, 8542310000; Number of D/A Converters: 2; Number of UART Channels: 2; Lifecycle Status: Production; Flash Memory Size: 1MB; Number of ADC Channels: 24

## Sheet Watchdog.SchDoc
size 420 x 297 mm; SheetNumber: 4; SheetTotal: 13
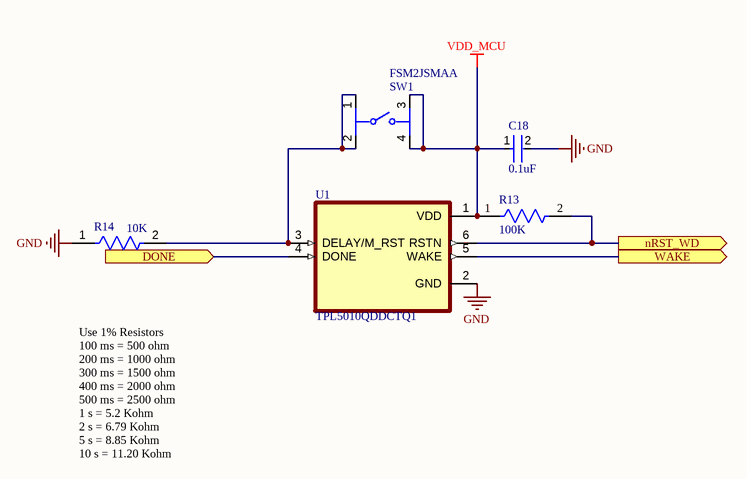
[diagram p4: Watchdog.SchDoc]

### Parts
C18  0.1uF  [FP-C0603C-CF-MFG]
R13  100K  [FP-ERA3A-MFG]
R14  10K  [FP-RK73B1J-MFG]
SW1  FSM2JSMAA  [FP-FSM2JSMAA-MFG]
U1  TPL5010QDDCTQ1  [SOT95P280X110-6N]

### Ports
DONE (in), nRST_WD (out), WAKE (out)

### Nets
GND: C18.2 R14.1 U1.2(GND)
VDD_MCU: C18.1 R13.1 SW1.3 SW1.4 U1.1(VDD)
DONE: U1.4(DONE) ; port DONE
nRESET: R13.2 U1.6(RSTN) ; port nRST_WD
WAKE: U1.5(WAKE) ; port WAKE
NetR14_2: R14.2 SW1.1 SW1.2 U1.3(DELAY/M_RST)

### Notes on the sheet
- Use 1% Resistors
  100 ms = 500 ohm
  200 ms = 1000 ohm
  300 ms = 1500 ohm
  400 ms = 2000 ohm
  500 ms = 2500 ohm
  1 s = 5.2 Kohm
  2 s = 6.79 Kohm
  5 s = 8.85 Kohm
  10 s = 11.20 Kohm
- THIS DOCUMENT AND THE DATA DISCLOSED HEREIN OR
- HEREWITH IS THE PROPERTY OF ALTIUM LIMITED AND MAY
- DWG NO:
- REVISION
- REV:
- DESCRIPTION
- DATE
- APPROVED
- BE FREELY DISTRIBUTED IN WHOLE. NO RIGHTS ARE
- RESERVED OR EXPRESS OR IMPLIED WARANTEE GIVEN.
- ENG:
- APPROVALS
- PROJECT
- DSN:
- CHK:
- REFERENCE DOCUMENTS
- PROJECT REVISION:
- TITLE
- DOCUMENT REVISION:
- DESIGN ITEM:
- BOM:
- FAB DWG:
- PCB DWG:
- ASSY DWG:
- SCALE:
- A3
- SIZE
- CAGE CODE
- FILE NAME
- DWG NO.
- SHEET
- OF
- REV

### Library data of the parts
C18 = CMP-2006-03061-2: as C2 on sheet MCU_Power; Temperature: -55°C to +125°C; RoHS: TRUE; Temperature Range High: +125°C; Lead Free: Yes; Octopart: https://octopart.com/c0603c104k5ractu-kemet-139244; Digikey Description: CAP CER 0.1UF 50V X7R 0603; Category: Cap; Package: C0603C-CF; ComponentLink2Description: Datasheet; Temperature Range Low: -55°C; Device Class L1: Passive Components; Voltage Rating: 50 V; Automotive: Yes; Device Class L3: Ceramic Capacitors; ComponentLink2URL: https://api.kemet.com/component-edge/download/datasheet/C0603C100J5GACAUTO.pdf; Capacitance: 0.10 μF; Device Class L2: Capacitors; Temperature Characteristic: X7R; Height: 0.87mm
R13 = CMP-2000-00875-2: NexarPartId: 1243428; Power Rating: 100mW; Voltage Rating (DC): 75V; Tolerance: 0.1%; Temperature Coefficient: 25ppm/°C; Resistance: 100kΩ; Contact Plating: Tin; Max Operating Temperature: 155°C; Case Code (Imperial): 0603; Packaging: Cut Tape; Width: 800µm; Lead Free: Lead Free; REACH SVHC: No SVHC; Termination: SMD/SMT; Radiation Hardening: No; Length: 1.6mm; Military Standard: Not; Features: Automotive AEC-Q200; Case/Package: 0603; Number of Terminations: 2; Composition: Thin Film; Schedule B: 8533210045, 8533210045; Voltage Rating: 75V; Mount: Surface Mount; Case Code (Metric): 1608; Lifecycle Status: Production; Height: 450µm; RoHS: Compliant; Number of Pins: 2; Max Power Dissipation: 100mW; Min Operating Temperature: -55°C; Depth: 800µm; Working Voltage: 75V
R14 = CMP-2000-01851-2: RES 10K OHM 5% 1/10W 0603; Temperature Coefficient: 200ppm/°C; Voltage Rating: 50V; Power Rating: 100mW; Resistance: 10kR; Length: 1.6mm; Lead Free: Lead Free; Resistance Tolerance: 5%; Case Code (Metric): 1608; Width: 0.8mm; Height: 0.45mm; Max Operating Temperature: 155°C; RoHS Compliant: Yes; Resistor Type: Thick Film; Min Operating Temperature: -55°C; Case Code (Imperial): 0603; Technology: THICK FILM; Package Quantity: 5000; Tolerance: 5%; Case/Package: 0603; Voltage Rating (DC): 50V; Depth: 0.8mm; Packaging: Tape and Reel; Number of Pins: 2; Construction: Rectangular; Series: RK73B; Military Standard: Not; Termination: SMD/SMT
SW1 = CMP-03402-000003-1: SWITCH TACTILE SPST-NO 0.05A 24V; Manufacturer: TE Connectivity; Standoff Height: 0.05mm; Contact Current Rating: 50mA; Electromechanical Life: 100000Cycles; Operating Force: 260gf; Contact Resistance: 100mΩ; Package: 0; Temperature Range High: +85°C; Temperature: -35°C to +85°C; Category: Switch; Manufacturer Part Number: FSM2JSMAA; RoHS: TRUE; Mouser Description: Tactile Switches TACTILE 260G FORCE S; Device Class L1: Electromechanical; Mount: Surface Mount; Height: 4.59mm; ComponentLink2URL: https://www.te.com/commerce/DocumentDelivery/DDEController?Action=showdoc&DocId=Customer+Drawing%7F2-1437565-7%7FV%7Fpdf%7FEnglish%7FENG_CD_2-1437565-7_V.pdf%7F2-1437565-8; Temperature Range Low: -35°C; Voltage Rating Dc: 24V; Lead Free: Yes; Automotive: No; Throw Configuration: SPST-NO; Octopart: https://octopart.com/fsm2jsmaa-te+connectivity-41720620; Device Class L2: Switches; Device Class L3: Pushbutton Switches; ComponentLink2Description: Datasheet; Digikey Description: SWITCH TACTILE SPST-NO 0.05A 24V
U1 = CMP-049-000000-1: Automotive AEC-Q100, nano-powered system timer with watchdog function; MF: Texas Instruments; MP: TPL5010QDDCTQ1; Check_prices: https://www.snapeda.com/parts/TPL5010QDDCTQ1/Texas+Instruments/view-part/?ref=eda; Source: TPL5010QDDCTQ1.SchLib; Package: SOT-23-THN-6 Texas Instruments; SnapEDA_Link: https://www.snapeda.com/parts/TPL5010QDDCTQ1/Texas+Instruments/view-part/?ref=snap; Component Type: Standard; Value: *; Pin Count: 6; Design Item ID: TPL5010QDDCTQ1

## Sheet CAN1.SchDoc
size 420 x 297 mm; SheetNumber: 11; SheetTotal: 13
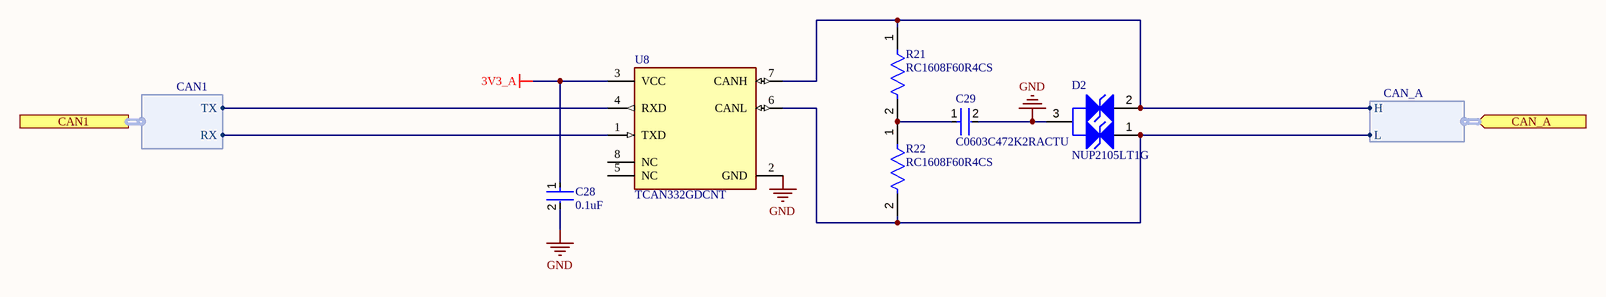
[diagram p5: CAN1.SchDoc]

### Parts
C28  0.1uF  [FP-C0603C-CF-MFG]
C29  C0603C472K2RACTU  [FP-C0603C-CF-MFG]
D2  NUP2105LT1G  [ONSC-SOT-23-3-318-08_V]
R21  RC1608F60R4CS  [FP-RC1608-IPC_C]
R22  RC1608F60R4CS  [FP-RC1608-IPC_C]
U8  TCAN332GDCNT  [FP-DCN0008A-IPC_C]

### Ports
CAN1 (harness CAN1), CAN_A (in, harness CAN_A)

### Harnesses
CAN_A: L, H
CAN1: TX, RX

### Nets
3V3_A: C28.1 U8.3(VCC)
GND: C28.2 C29.2 D2.3(K) U8.2(GND)
CAN1_RX: U8.1(TXD) ; port CAN1.RX
CAN1_TX: U8.4(RXD) ; port CAN1.TX
CAN_A_H: D2.2(K) R21.1 U8.7(CANH) ; port CAN_A.H
CAN_A_L: D2.1(K) R22.2 U8.6(CANL) ; port CAN_A.L
NetC29_1: C29.1 R21.2 R22.1

Not connected (* = marked no-connect by the designer): U8 5(NC) 8(NC)

### Notes on the sheet
- THIS DOCUMENT AND THE DATA DISCLOSED HEREIN OR
- HEREWITH IS THE PROPERTY OF ALTIUM LIMITED AND MAY
- DWG NO:
- REVISION
- REV:
- DESCRIPTION
- DATE
- APPROVED
- BE FREELY DISTRIBUTED IN WHOLE. NO RIGHTS ARE
- RESERVED OR EXPRESS OR IMPLIED WARANTEE GIVEN.
- ENG:
- APPROVALS
- PROJECT
- DSN:
- CHK:
- REFERENCE DOCUMENTS
- PROJECT REVISION:
- TITLE
- DOCUMENT REVISION:
- DESIGN ITEM:
- BOM:
- FAB DWG:
- PCB DWG:
- ASSY DWG:
- SCALE:
- A3
- SIZE
- CAGE CODE
- FILE NAME
- DWG NO.
- SHEET
- OF
- REV

### Library data of the parts
C28 = CMP-2006-03061-2: as C2 on sheet MCU_Power; Temperature: -55°C to +125°C; RoHS: TRUE; Temperature Range High: +125°C; Lead Free: Yes; Octopart: https://octopart.com/c0603c104k5ractu-kemet-139244; Digikey Description: CAP CER 0.1UF 50V X7R 0603; Category: Cap; Package: C0603C-CF; ComponentLink2Description: Datasheet; Temperature Range Low: -55°C; Device Class L1: Passive Components; Voltage Rating: 50 V; Automotive: Yes; Device Class L3: Ceramic Capacitors; ComponentLink2URL: https://api.kemet.com/component-edge/download/datasheet/C0603C100J5GACAUTO.pdf; Capacitance: 0.10 μF; Device Class L2: Capacitors; Temperature Characteristic: X7R; Height: 0.87mm
C29 = CMP-2006-03218-2: CAP CER 4700PF 200V 10% X7R 0603; Manufacturer: KEMET; Capacitance: 4,700 pF; Material: Ceramic; Value: 4,700 pF; Automotive Grade: Grade 1; Temperature Coefficient: 30ppm/°C; Tolerance: 0.1; Manufacturer Part Number: C0603C472K2RACTU; Height: 0.87mm; Temperature Range High: +125°C; Package: C0603C-CF; Octopart: https://octopart.com/c0603c472k2ractu-kemet-17058096; Lead Free: Yes; Device Class L2: Capacitors; Automotive: Yes; Temperature Characteristic: X7R; RoHS: TRUE; Digikey Description: CAP CER 4700PF 200V 10% X7R 0603; Voltage Rating: 200 V; ComponentLink2URL: https://api.kemet.com/component-edge/download/datasheet/C0603C100J5GACAUTO.pdf; Device Class L3: Ceramic Capacitors; Temperature Range Low: -55°C; Category: Cap; Temperature: -55°C to +125°C; ComponentLink2Description: Datasheet; Device Class L1: Passive Components
D2 = CMP-1063-00164-1: Dual Line CAN Bus Protector, 3-Pin SOT-23, Pb-Free, Tape and Reel; Manufacturer: On Semiconductor; IR Max (uA): 0.1; Number of Lines: 2; Direction: Bidirectional; C Max (pF): 30; PPK Max (W): 350; V(BR) Min (V): 26.2; ComponentLink3URL: http://www.onsemi.cn/pub_link/Collateral/318-08.PDF; Mounting Technology: Surface Mount; ComponentLink2Description: Datasheet; PartNumber: NUP2105LT1G; ComponentLink1URL: http://www.onsemi.com/; PackageVersion: Rev. AP, 11/2009; DatasheetVersion: Rev. 5; RoHS: Pb-Free; PackageReference: SOT-23-3-318-08; ComponentLink2URL: http://www.onsemi.cn/pub_link/Collateral/NUP2105L-D.PDF; ComponentLink1Description: Manufacturer URL; PackageDescription: 3-Pin Small Outline Transistor, Body 2.92 x 1.3 mm, Pitch 0.95 mm; Packing: Tape and Reel; ComponentLink3Description: Package Specification
R21 R22 = CMP-13261-005441-1: Res Thick Film 0603 60.4Ω 1% 0.1W ±100ppm/°C Molded SMD T/R; Max Power Dissipation: 100mW; Resistance: 60.4R; Voltage Rating (DC): 50V; Case Code (Metric): 1608; Packaging: Tape and Reel; Max Operating Temperature: 155°C; Length: 0.063inch; Temperature Coefficient: 100ppm/°C; Contact Plating: Tin; Tolerance: 1%; Depth: 0.8mm; Case/Package: 0603; Features: Moisture Resistant; Number of Terminations: 2; Min Operating Temperature: -55°C; Power Rating: 100mW; Height: 0.022inch; Composition: Thick Film; Case Code (Imperial): 0603; Military Standard: Not; Radiation Hardening: No; Lead Free: Lead Free; Width: 0.031inch
U8 = CMP-04872-000198-1: IC TRANSCEIVER 1/1 SOT23-8; Min Supply Voltage: 3V; Max Supply Voltage: 3.6V; Interface: CAN; Packaging: Cut Tape; Max Operating Temperature: 125°C; RoHS Compliant: Yes; REACH SVHC: No SVHC; Min Operating Temperature: -40°C; Lead Free: Lead Free; Number of Pins: 8; Case/Package: SOT-23

## Sheet CAN2.SchDoc
size 420 x 297 mm; SheetNumber: 12; SheetTotal: 13
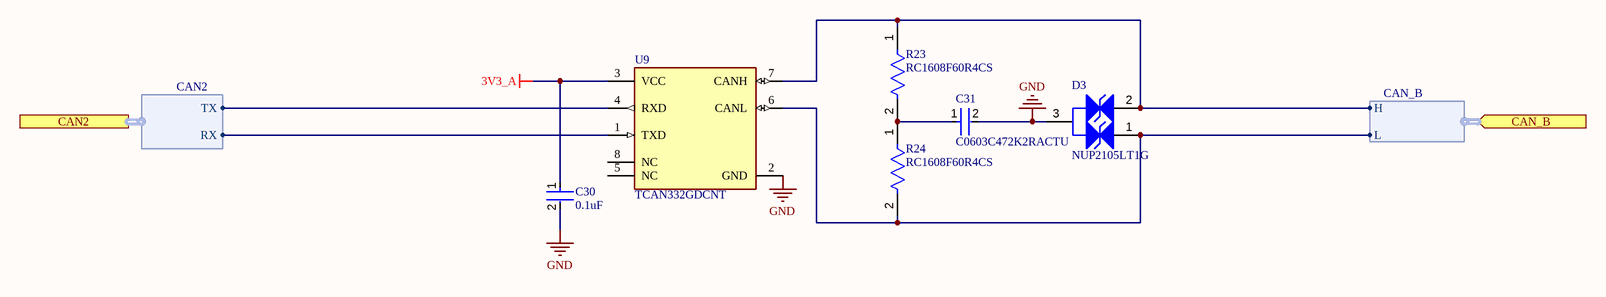
[diagram p6: CAN2.SchDoc]

### Parts
C30  0.1uF  [FP-C0603C-CF-MFG]
C31  C0603C472K2RACTU  [FP-C0603C-CF-MFG]
D3  NUP2105LT1G  [ONSC-SOT-23-3-318-08_V]
R23  RC1608F60R4CS  [FP-RC1608-IPC_C]
R24  RC1608F60R4CS  [FP-RC1608-IPC_C]
U9  TCAN332GDCNT  [FP-DCN0008A-IPC_C]

### Ports
CAN2 (harness CAN2), CAN_B (in, harness CAN_B)

### Harnesses
CAN_B: L, H
CAN2: TX, RX

### Nets
3V3_A: C30.1 U9.3(VCC)
GND: C30.2 C31.2 D3.3(K) U9.2(GND)
CAN2_RX: U9.1(TXD) ; port CAN2.RX
CAN2_TX: U9.4(RXD) ; port CAN2.TX
CAN_B_H: D3.2(K) R23.1 U9.7(CANH) ; port CAN_B.H
CAN_B_L: D3.1(K) R24.2 U9.6(CANL) ; port CAN_B.L
NetC31_1: C31.1 R23.2 R24.1

Not connected (* = marked no-connect by the designer): U9 5(NC) 8(NC)

### Notes on the sheet
- THIS DOCUMENT AND THE DATA DISCLOSED HEREIN OR
- HEREWITH IS THE PROPERTY OF ALTIUM LIMITED AND MAY
- DWG NO:
- REVISION
- REV:
- DESCRIPTION
- DATE
- APPROVED
- BE FREELY DISTRIBUTED IN WHOLE. NO RIGHTS ARE
- RESERVED OR EXPRESS OR IMPLIED WARANTEE GIVEN.
- ENG:
- APPROVALS
- PROJECT
- DSN:
- CHK:
- REFERENCE DOCUMENTS
- PROJECT REVISION:
- TITLE
- DOCUMENT REVISION:
- DESIGN ITEM:
- BOM:
- FAB DWG:
- PCB DWG:
- ASSY DWG:
- SCALE:
- A3
- SIZE
- CAGE CODE
- FILE NAME
- DWG NO.
- SHEET
- OF
- REV

### Library data of the parts
C30 = CMP-2006-03061-2: as C2 on sheet MCU_Power; Temperature: -55°C to +125°C; RoHS: TRUE; Temperature Range High: +125°C; Lead Free: Yes; Octopart: https://octopart.com/c0603c104k5ractu-kemet-139244; Digikey Description: CAP CER 0.1UF 50V X7R 0603; Category: Cap; Package: C0603C-CF; ComponentLink2Description: Datasheet; Temperature Range Low: -55°C; Device Class L1: Passive Components; Voltage Rating: 50 V; Automotive: Yes; Device Class L3: Ceramic Capacitors; ComponentLink2URL: https://api.kemet.com/component-edge/download/datasheet/C0603C100J5GACAUTO.pdf; Capacitance: 0.10 μF; Device Class L2: Capacitors; Temperature Characteristic: X7R; Height: 0.87mm
C31 = CMP-2006-03218-2: as C29 on sheet CAN1; Manufacturer Part Number: C0603C472K2RACTU; Height: 0.87mm; Temperature Range High: +125°C; Package: C0603C-CF; Octopart: https://octopart.com/c0603c472k2ractu-kemet-17058096; Lead Free: Yes; Device Class L2: Capacitors; Automotive: Yes; Temperature Characteristic: X7R; RoHS: TRUE; Digikey Description: CAP CER 4700PF 200V 10% X7R 0603; Voltage Rating: 200 V; ComponentLink2URL: https://api.kemet.com/component-edge/download/datasheet/C0603C100J5GACAUTO.pdf; Device Class L3: Ceramic Capacitors; Temperature Range Low: -55°C; Category: Cap; Temperature: -55°C to +125°C; ComponentLink2Description: Datasheet; Device Class L1: Passive Components
D3 = CMP-1063-00164-1: as D2 on sheet CAN1; ComponentLink3URL: http://www.onsemi.cn/pub_link/Collateral/318-08.PDF; Mounting Technology: Surface Mount; ComponentLink2Description: Datasheet; PartNumber: NUP2105LT1G; ComponentLink1URL: http://www.onsemi.com/; PackageVersion: Rev. AP, 11/2009; DatasheetVersion: Rev. 5; RoHS: Pb-Free; PackageReference: SOT-23-3-318-08; ComponentLink2URL: http://www.onsemi.cn/pub_link/Collateral/NUP2105L-D.PDF; ComponentLink1Description: Manufacturer URL; PackageDescription: 3-Pin Small Outline Transistor, Body 2.92 x 1.3 mm, Pitch 0.95 mm; Packing: Tape and Reel; ComponentLink3Description: Package Specification
R23 R24 = CMP-13261-005441-1: as R21 on sheet CAN1; Case Code (Metric): 1608; Packaging: Tape and Reel; Max Operating Temperature: 155°C; Length: 0.063inch; Temperature Coefficient: 100ppm/°C; Contact Plating: Tin; Tolerance: 1%; Depth: 0.8mm; Case/Package: 0603; Features: Moisture Resistant; Number of Terminations: 2; Min Operating Temperature: -55°C; Power Rating: 100mW; Height: 0.022inch; Composition: Thick Film; Case Code (Imperial): 0603; Military Standard: Not; Radiation Hardening: No; Lead Free: Lead Free; Width: 0.031inch
U9 = CMP-04872-000198-1: as U8 on sheet CAN1; Packaging: Cut Tape; Max Operating Temperature: 125°C; RoHS Compliant: Yes; REACH SVHC: No SVHC; Min Operating Temperature: -40°C; Lead Free: Lead Free; Number of Pins: 8; Case/Package: SOT-23

## Sheet MRAM_MR25H40.SchDoc
size 420 x 297 mm; SheetNumber: 9; SheetTotal: 13
Used 2 times, as channels M1, M2. Parts and nets are listed once, with the designators drawn on the sheet.
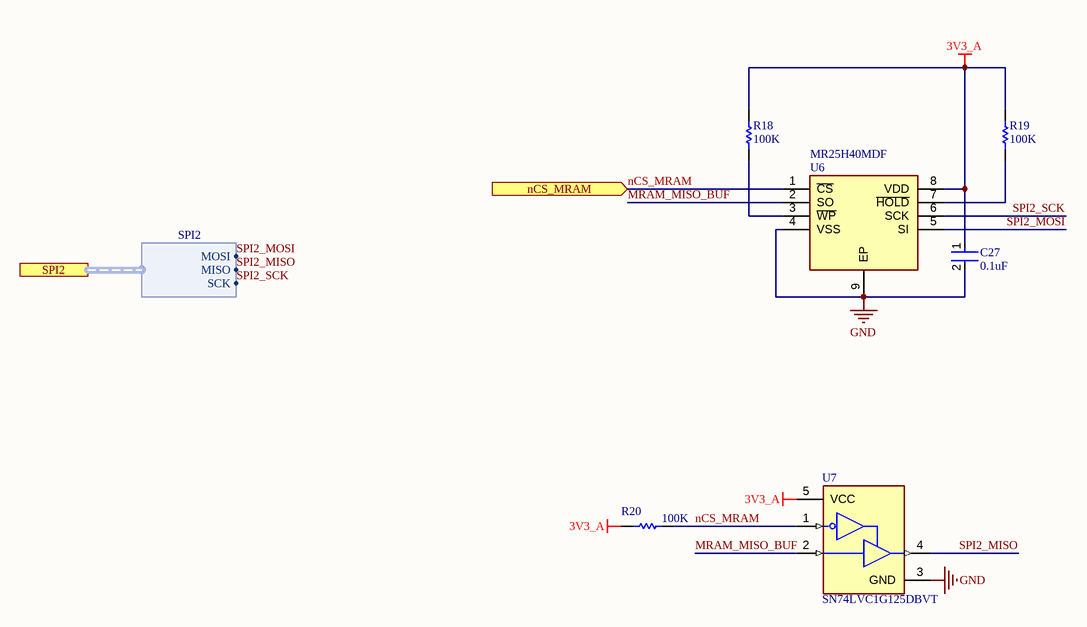
[diagram p7: MRAM_MR25H40.SchDoc]

### Parts
C27  0.1uF  [FP-C0603C-CF-MFG]
R18  100K  [RESC1608X55X30ML20T10]
R19  100K  [RESC1608X55X30ML20T10]
R20  100K  [RESC1608X55X30ML20T10]
U6  MR25H40MDF  [SON127P600X500X90-9N-D]
U7  SN74LVC1G125DBVT  [FP-DBV0005A-MFG]

### Ports
nCS_MRAM (in), SPI2 (harness SPI2)

### Harnesses
SPI2: MOSI, MISO, SCK

### Nets
3V3_A: C27.1 R18.1 R19.1 R20.2 U6.8(VDD) U7.5(VCC)
GND: C27.2 U6.4(VSS) U6.9(EP) U7.3(GND)
MRAM_MISO_BUF: U6.2(SO) U7.2(A)
nCS_MRAM: R20.1 U6.1(~{CS}) U7.1(~{OE}) ; port nCS_MRAM
SPI2_MISO: U7.4(Y) ; port SPI2.MISO
SPI2_MOSI: U6.5(SI) ; port SPI2.MOSI
SPI2_SCK: U6.6(SCK) ; port SPI2.SCK
NetR18_2: R18.2 U6.3(~{WP})
NetR19_2: R19.2 U6.7(~{HOLD})

### Channels
M1: designators end in _M1; ports nCS_MRAM=nCS_MRAM
M2: designators end in _M2; ports nCS_MRAM=nCS_MRAM

### Notes on the sheet
- THIS DOCUMENT AND THE DATA DISCLOSED HEREIN OR
- HEREWITH IS THE PROPERTY OF ALTIUM LIMITED AND MAY
- DWG NO:
- REVISION
- REV:
- DESCRIPTION
- DATE
- APPROVED
- BE FREELY DISTRIBUTED IN WHOLE. NO RIGHTS ARE
- RESERVED OR EXPRESS OR IMPLIED WARANTEE GIVEN.
- ENG:
- APPROVALS
- PROJECT
- DSN:
- CHK:
- REFERENCE DOCUMENTS
- PROJECT REVISION:
- TITLE
- DOCUMENT REVISION:
- DESIGN ITEM:
- BOM:
- FAB DWG:
- PCB DWG:
- ASSY DWG:
- SCALE:
- A3
- SIZE
- CAGE CODE
- FILE NAME
- DWG NO.
- SHEET
- OF
- REV

### Library data of the parts
C27 = CMP-2006-03061-2: as C2 on sheet MCU_Power; Temperature: -55°C to +125°C; RoHS: TRUE; Temperature Range High: +125°C; Lead Free: Yes; Octopart: https://octopart.com/c0603c104k5ractu-kemet-139244; Digikey Description: CAP CER 0.1UF 50V X7R 0603; Category: Cap; Package: C0603C-CF; ComponentLink2Description: Datasheet; Temperature Range Low: -55°C; Device Class L1: Passive Components; Voltage Rating: 50 V; Automotive: Yes; Device Class L3: Ceramic Capacitors; ComponentLink2URL: https://api.kemet.com/component-edge/download/datasheet/C0603C100J5GACAUTO.pdf; Capacitance: 0.10 μF; Device Class L2: Capacitors; Temperature Characteristic: X7R; Height: 0.87mm
R18-R20 = CMP-2000-01852-1: Part Number: RK73B1JTTD104J; Manufacturer: KOA Speer
U6 = MR25H40MDF: Integrated Circuit; Manufacturer_Name: Everspin Technologies; Datasheet Link: https://datasheet.datasheetarchive.com/originals/distributors/Datasheets-DGA23/1514724.pdf; Height: 0.9mm; Manufacturer_Part_Number: MR25H40MDF; Mouser Part Number: 936-MR25H40MDF; Mouser Price/Stock: https://www.mouser.co.uk/ProductDetail/Everspin-Technologies/MR25H40MDF?qs=laR3Dyet2Vc5UBOlfE70WA%3D%3D; Arrow Part Number: MR25H40MDF; Arrow Price/Stock: https://www.arrow.com/en/products/mr25h40mdf/everspin-technologies?utm_currency=USD&region=europe
U7 = CMP-0859-00018-4: IC BUF NON-INVERT 5.5V SOT23-5; Manufacturer: Texas Instruments; Min Supply Voltage: 1.65V; Number Of Outputs: 1; Propagation Delay: 4.2ns; Logic Function Desc: Non-Inverting; Nominal Supply Current: 10uA; Standoff Height: 0mm; ComponentLink2Description: Datasheet; Temperature Range High: +125°C; Octopart: https://octopart.com/sn74lvc1g125dbvt-texas+instruments-1006799; Ambient Temperature Range Low: -40°C; Temperature: -40°C to +125°C; Mouser Description: Buffers & Line Drivers SNGL Bus Buffer Gate; Automotive: No; RoHS: TRUE; Device Class L2: Logic ICs; Ambient Temperature Range High: +125°C; ComponentLink2URL: http://www.ti.com/lit/ds/symlink/sn74lvc1g125.pdf; Height: 1.45mm; Number Of Circuits: 1; Device Class L1: Integrated Circuits (ICs); Max Supply Voltage: 5.5V; Manufacturer Part Number: SN74LVC1G125DBVT; Temperature Range Low: -40°C; Package: DBV0005A; Device Class L3: Logic Gates; Number Of Inputs: 1; Lead Free: Yes; Category: IC; Digikey Description: IC BUF NON-INVERT 5.5V SOT23-5

## Sheet MAG_MMC5983MA.SchDoc
size 420 x 297 mm; SheetNumber: 7; SheetTotal: 13
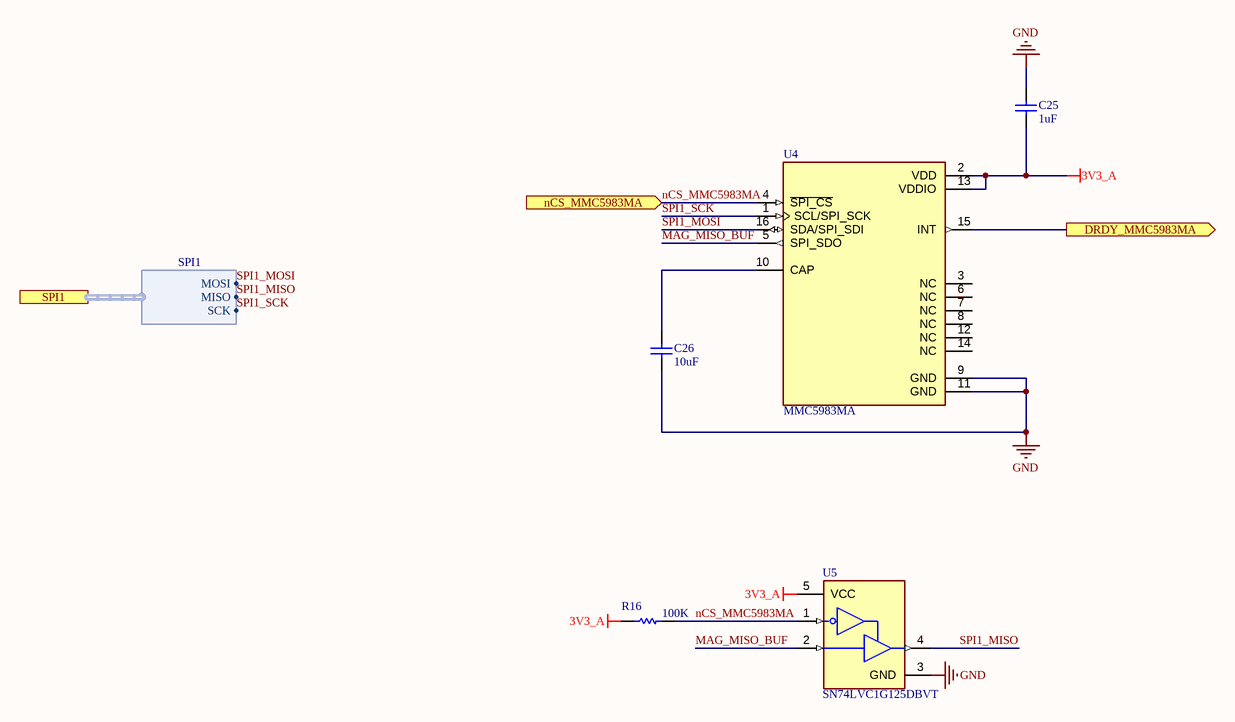
[diagram p8: MAG_MMC5983MA.SchDoc]

### Parts
C25  1uF  [CAPC1608X90X35LL15T15]
C26  10uF  [CAPC2013X145X50LL20T25]
R16  100K  [RESC1608X55X30ML20T10]
U4  MMC5983MA  [PQFN50P300X300X100-16N]
U5  SN74LVC1G125DBVT  [FP-DBV0005A-MFG]

### Ports
DRDY_MMC5983MA (out), nCS_MMC5983MA (in), SPI1 (harness SPI1)

### Harnesses
SPI1: MOSI, MISO, SCK

### Nets
3V3_A: C25.1 R16.2 U4.2(VDD) U4.13(VDDIO) U5.5(VCC)
GND: C25.2 C26.2 U4.9(GND) U4.11(GND) U5.3(GND)
DRDY_MMC5983MA: U4.15(INT) ; port DRDY_MMC5983MA
MAG_MISO_BUF: U4.5(SPI_SDO) U5.2(A)
nCS_MMC5983MA: R16.1 U4.4(~{SPI_CS}) U5.1(~{OE}) ; port nCS_MMC5983MA
SPI1_MISO: U5.4(Y) ; port SPI1.MISO
SPI1_MOSI: U4.16(SDA/SPI_SDI) ; port SPI1.MOSI
SPI1_SCK: U4.1(SCL/SPI_SCK) ; port SPI1.SCK
NetC26_1: C26.1 U4.10(CAP)

Not connected (* = marked no-connect by the designer): U4 3(NC) 6(NC) 7(NC) 8(NC) 12(NC) 14(NC)

### Notes on the sheet
- THIS DOCUMENT AND THE DATA DISCLOSED HEREIN OR
- HEREWITH IS THE PROPERTY OF ALTIUM LIMITED AND MAY
- DWG NO:
- REVISION
- REV:
- DESCRIPTION
- DATE
- APPROVED
- BE FREELY DISTRIBUTED IN WHOLE. NO RIGHTS ARE
- RESERVED OR EXPRESS OR IMPLIED WARANTEE GIVEN.
- ENG:
- APPROVALS
- PROJECT
- DSN:
- CHK:
- REFERENCE DOCUMENTS
- PROJECT REVISION:
- TITLE
- DOCUMENT REVISION:
- DESIGN ITEM:
- BOM:
- FAB DWG:
- PCB DWG:
- ASSY DWG:
- SCALE:
- A3
- SIZE
- CAGE CODE
- FILE NAME
- DWG NO.
- SHEET
- OF
- REV

### Library data of the parts
C25 = CMP-2006-02298-2: as C15 on sheet MCU_Power
C26 = CMP-2007-01044-1: Manufacturer: Kemet; Part Number: C0805C106K8RACTU
R16 = CMP-2000-01852-1: as R18 on sheet MRAM_MR25H40
U4 = CMP-051-000000-1: MMC5983 series Magnetic, Magnetometer Sensor Evaluation Board; MF: Memsic Inc.; Component Type: Standard; Price: None; Source: MMC5983MA.SchLib; Value: *; MP: MMC5983MA; Design Item ID: MMC5983MA; Package: VFLGA-16 Memsic Inc.; Pin Count: 16; Availability: In Stock; Purchase-URL: https://pricing.snapeda.com/search/part/MMC5983MA/?ref=eda; SnapEDA_Link: https://www.snapeda.com/parts/MMC5983MA/Memsic+Inc./view-part/?ref=snap; Check_prices: https://www.snapeda.com/parts/MMC5983MA/Memsic+Inc./view-part/?ref=eda
U5 = CMP-0859-00018-4: as U7 on sheet MRAM_MR25H40; ComponentLink2Description: Datasheet; Temperature Range High: +125°C; Octopart: https://octopart.com/sn74lvc1g125dbvt-texas+instruments-1006799; Ambient Temperature Range Low: -40°C; Temperature: -40°C to +125°C; Mouser Description: Buffers & Line Drivers SNGL Bus Buffer Gate; Automotive: No; RoHS: TRUE; Device Class L2: Logic ICs; Ambient Temperature Range High: +125°C; ComponentLink2URL: http://www.ti.com/lit/ds/symlink/sn74lvc1g125.pdf; Height: 1.45mm; Number Of Circuits: 1; Device Class L1: Integrated Circuits (ICs); Max Supply Voltage: 5.5V; Manufacturer Part Number: SN74LVC1G125DBVT; Temperature Range Low: -40°C; Package: DBV0005A; Device Class L3: Logic Gates; Number Of Inputs: 1; Lead Free: Yes; Category: IC; Digikey Description: IC BUF NON-INVERT 5.5V SOT23-5

## Sheet IMU_ISM330ISN.SchDoc
size 420 x 297 mm; SheetNumber: 6; SheetTotal: 13
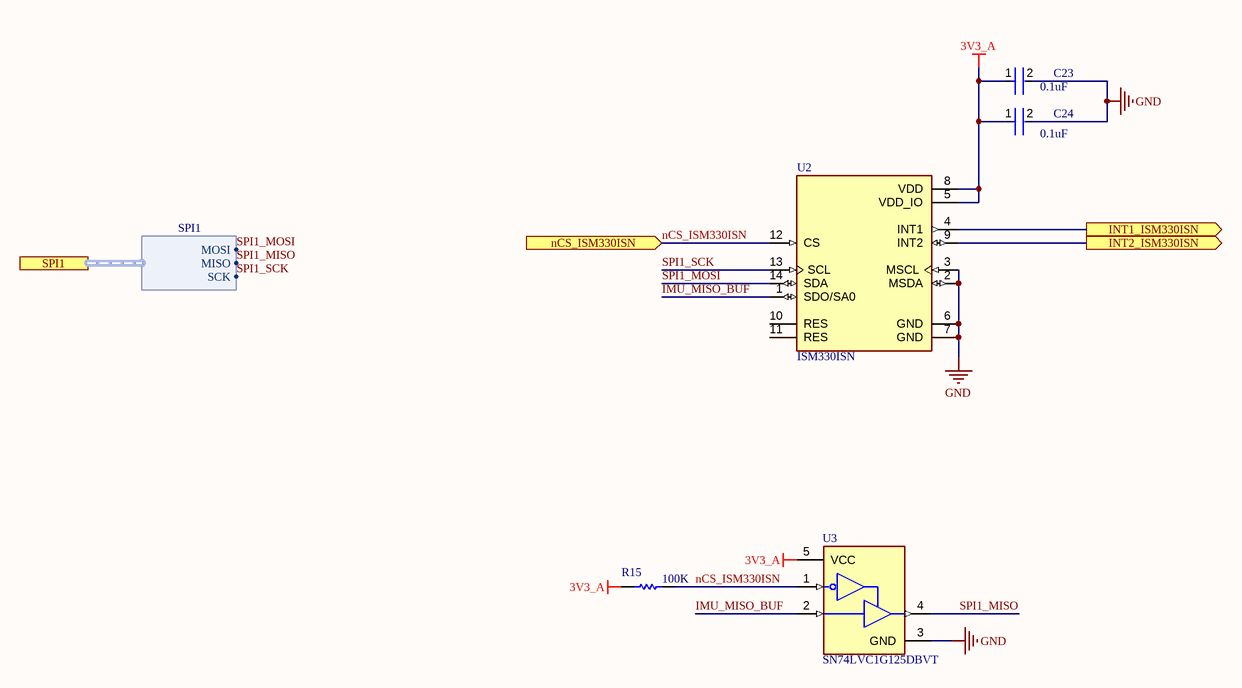
[diagram p9: IMU_ISM330ISN.SchDoc]

### Parts
C23  0.1uF  [FP-C0603C-CF-MFG]
C24  0.1uF  [FP-C0603C-CF-MFG]
R15  100K  [RESC1608X55X30ML20T10]
U2  ISM330ISN  [XDCR_ISM330ISNTR]
U3  SN74LVC1G125DBVT  [FP-DBV0005A-MFG]

### Ports
INT1_ISM330ISN (out), INT2_ISM330ISN (out), nCS_ISM330ISN (in), SPI1 (harness SPI1)

### Harnesses
SPI1: MOSI, MISO, SCK

### Nets
3V3_A: C23.1 C24.1 R15.2 U2.5(VDD_IO) U2.8(VDD) U3.5(VCC)
GND: C23.2 C24.2 U2.2(MSDA) U2.3(MSCL) U2.6(GND) U2.7(GND) U3.3(GND)
IMU_MISO_BUF: U2.1(SDO/SA0) U3.2(A)
INT1_ISM330ISN: U2.4(INT1) ; port INT1_ISM330ISN
INT2_ISM330ISN: U2.9(INT2) ; port INT2_ISM330ISN
nCS_ISM330ISN: R15.1 U2.12(CS) U3.1(~{OE}) ; port nCS_ISM330ISN
SPI1_MISO: U3.4(Y) ; port SPI1.MISO
SPI1_MOSI: U2.14(SDA) ; port SPI1.MOSI
SPI1_SCK: U2.13(SCL) ; port SPI1.SCK

Not connected (* = marked no-connect by the designer): U2 10(RES) 11(RES)

### Notes on the sheet
- THIS DOCUMENT AND THE DATA DISCLOSED HEREIN OR
- HEREWITH IS THE PROPERTY OF ALTIUM LIMITED AND MAY
- DWG NO:
- REVISION
- REV:
- DESCRIPTION
- DATE
- APPROVED
- BE FREELY DISTRIBUTED IN WHOLE. NO RIGHTS ARE
- RESERVED OR EXPRESS OR IMPLIED WARANTEE GIVEN.
- ENG:
- APPROVALS
- PROJECT
- DSN:
- CHK:
- REFERENCE DOCUMENTS
- PROJECT REVISION:
- TITLE
- DOCUMENT REVISION:
- DESIGN ITEM:
- BOM:
- FAB DWG:
- PCB DWG:
- ASSY DWG:
- SCALE:
- A3
- SIZE
- CAGE CODE
- FILE NAME
- DWG NO.
- SHEET
- OF
- REV

### Library data of the parts
C23 C24 = CMP-2006-03061-2: as C2 on sheet MCU_Power; Temperature: -55°C to +125°C; RoHS: TRUE; Temperature Range High: +125°C; Lead Free: Yes; Octopart: https://octopart.com/c0603c104k5ractu-kemet-139244; Digikey Description: CAP CER 0.1UF 50V X7R 0603; Category: Cap; Package: C0603C-CF; ComponentLink2Description: Datasheet; Temperature Range Low: -55°C; Device Class L1: Passive Components; Voltage Rating: 50 V; Automotive: Yes; Device Class L3: Ceramic Capacitors; ComponentLink2URL: https://api.kemet.com/component-edge/download/datasheet/C0603C100J5GACAUTO.pdf; Capacitance: 0.10 μF; Device Class L2: Capacitors; Temperature Characteristic: X7R; Height: 0.87mm
R15 = CMP-2000-01852-1: as R18 on sheet MRAM_MR25H40
U2 = CMP-064-000000-1: Accelerometer, Gyroscope, Temperature, 6 Axis Sensor I2C, SPI Output; MF: STMicroelectronics; SnapEDA_Link: https://www.snapeda.com/parts/ISM330ISNTR/STMicroelectronics/view-part/?ref=snap; Check_prices: https://www.snapeda.com/parts/ISM330ISNTR/STMicroelectronics/view-part/?ref=eda; Package: VFLGA-14 STMicroelectronics; Pin Count: 14; Source: ISM330ISNTR.SchLib; Component Type: Standard; Design Item ID: ISM330ISNTR; Value: *; MP: ISM330ISNTR
U3 = CMP-0859-00018-4: as U7 on sheet MRAM_MR25H40; ComponentLink2Description: Datasheet; Temperature Range High: +125°C; Octopart: https://octopart.com/sn74lvc1g125dbvt-texas+instruments-1006799; Ambient Temperature Range Low: -40°C; Temperature: -40°C to +125°C; Mouser Description: Buffers & Line Drivers SNGL Bus Buffer Gate; Automotive: No; RoHS: TRUE; Device Class L2: Logic ICs; Ambient Temperature Range High: +125°C; ComponentLink2URL: http://www.ti.com/lit/ds/symlink/sn74lvc1g125.pdf; Height: 1.45mm; Number Of Circuits: 1; Device Class L1: Integrated Circuits (ICs); Max Supply Voltage: 5.5V; Manufacturer Part Number: SN74LVC1G125DBVT; Temperature Range Low: -40°C; Package: DBV0005A; Device Class L3: Logic Gates; Number Of Inputs: 1; Lead Free: Yes; Category: IC; Digikey Description: IC BUF NON-INVERT 5.5V SOT23-5